# EAGLE design UltiMem_v1.01 (EAGLE 7.6.0)

## Sheet 1 of 5: LOGIC
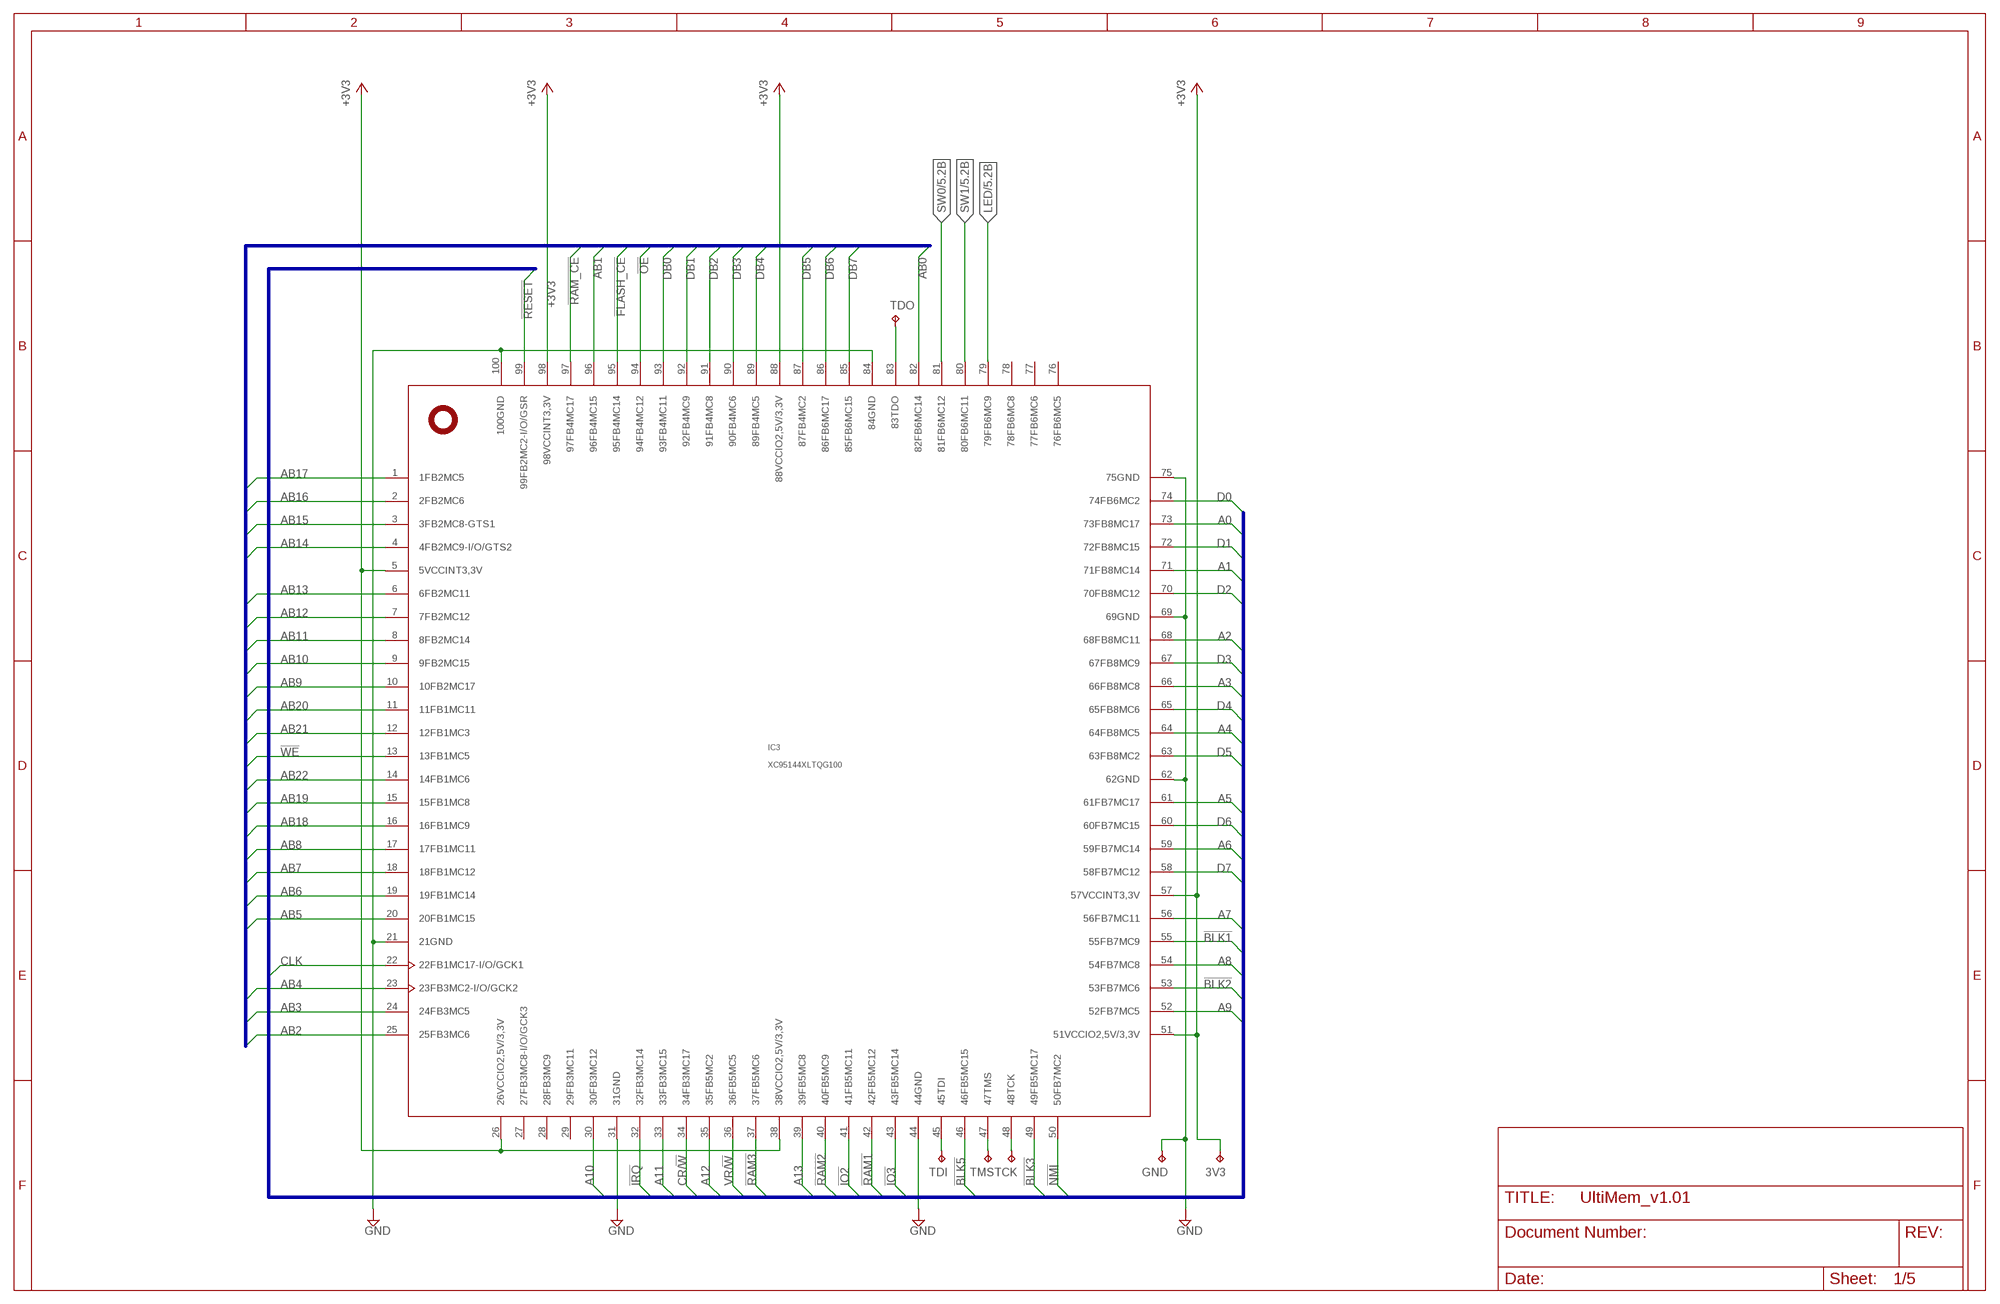
[diagram p0: schematic, sheet 1]

### Parts
3V3  TPTP08R  [TP08R]
GND  TPTP08R  [TP08R]
IC3  XC95144XLTQG100  [TQFP100]
TCK  TPTP08R  [TP08R]
TDI  TPTP08R  [TP08R]
TDO  TPTP08R  [TP08R]
TMS  TPTP08R  [TP08R]

### Nets
!BLK1: IC3.55(55FB7MC9) ; also sheet 3
!BLK2: IC3.53(53FB7MC6) ; also sheet 3
!BLK3: IC3.49(49FB5MC17) ; also sheet 3
!BLK5: IC3.46(46FB5MC15) ; also sheet 3
!FLASH_CE: IC3.95(95FB4MC14) ; also sheet 2
!IO2: IC3.41(41FB5MC11) ; also sheet 3
!IO3: IC3.43(43FB5MC14) ; also sheet 3
!IRQ: IC3.32(32FB3MC14) ; also sheet 3
!NMI: IC3.50(50FB7MC2) ; also sheet 3
!OE: IC3.94(94FB4MC12) ; also sheet 2
!RAM1: IC3.42(42FB5MC12) ; also sheet 3
!RAM2: IC3.40(40FB5MC9) ; also sheet 3
!RAM3: IC3.37(37FB5MC6) ; also sheet 3
!RAM_CE: IC3.97(97FB4MC17) ; also sheet 2
!RESET: IC3.99(99FB2MC2-I/O/GSR) ; also sheet 2,3,5
!WE: IC3.13(13FB1MC5) ; also sheet 2
+3V3: 3V3.TP IC3.5(5VCCINT3,3V) IC3.26(26VCCIO2,5V/3,3V) IC3.38(38VCCIO2,5V/3,3V) IC3.51(51VCCIO2,5V/3,3V) IC3.57(57VCCINT3,3V) IC3.88(88VCCIO2,5V/3,3V) IC3.98(98VCCINT3,3V) ; also sheet 2,4,5
A0: IC3.73(73FB8MC17) ; also sheet 3
A1: IC3.71(71FB8MC14) ; also sheet 3
A2: IC3.68(68FB8MC11) ; also sheet 3
A3: IC3.66(66FB8MC8) ; also sheet 3
A4: IC3.64(64FB8MC5) ; also sheet 3
A5: IC3.61(61FB7MC17) ; also sheet 3
A6: IC3.59(59FB7MC14) ; also sheet 3
A7: IC3.56(56FB7MC11) ; also sheet 3
A8: IC3.54(54FB7MC8) ; also sheet 3
A9: IC3.52(52FB7MC5) ; also sheet 3
A10: IC3.30(30FB3MC12) ; also sheet 3
A11: IC3.33(33FB3MC15) ; also sheet 3
A12: IC3.35(35FB5MC2) ; also sheet 3
A13: IC3.39(39FB5MC8) ; also sheet 3
AB0: IC3.82(82FB6MC14) ; also sheet 2
AB1: IC3.96(96FB4MC15) ; also sheet 2
AB2: IC3.25(25FB3MC6) ; also sheet 2
AB3: IC3.24(24FB3MC5) ; also sheet 2
AB4: IC3.23(23FB3MC2-I/O/GCK2) ; also sheet 2
AB5: IC3.20(20FB1MC15) ; also sheet 2
AB6: IC3.19(19FB1MC14) ; also sheet 2
AB7: IC3.18(18FB1MC12) ; also sheet 2
AB8: IC3.17(17FB1MC11) ; also sheet 2
AB9: IC3.10(10FB2MC17) ; also sheet 2
AB10: IC3.9(9FB2MC15) ; also sheet 2
AB11: IC3.8(8FB2MC14) ; also sheet 2
AB12: IC3.7(7FB2MC12) ; also sheet 2
AB13: IC3.6(6FB2MC11) ; also sheet 2
AB14: IC3.4(4FB2MC9-I/O/GTS2) ; also sheet 2
AB15: IC3.3(3FB2MC8-GTS1) ; also sheet 2
AB16: IC3.2(2FB2MC6) ; also sheet 2
AB17: IC3.1(1FB2MC5) ; also sheet 2
AB18: IC3.16(16FB1MC9) ; also sheet 2
AB19: IC3.15(15FB1MC8) ; also sheet 2
AB20: IC3.11(11FB1MC11) ; also sheet 2
AB21: IC3.12(12FB1MC3) ; also sheet 2
AB22: IC3.14(14FB1MC6) ; also sheet 2
CLK: IC3.22(22FB1MC17-I/O/GCK1) ; also sheet 3
CR/!W: IC3.34(34FB3MC17) ; also sheet 3
D0: IC3.74(74FB6MC2) ; also sheet 3
D1: IC3.72(72FB8MC15) ; also sheet 3
D2: IC3.70(70FB8MC12) ; also sheet 3
D3: IC3.67(67FB8MC9) ; also sheet 3
D4: IC3.65(65FB8MC6) ; also sheet 3
D5: IC3.63(63FB8MC2) ; also sheet 3
D6: IC3.60(60FB7MC15) ; also sheet 3
D7: IC3.58(58FB7MC12) ; also sheet 3
DB0: IC3.93(93FB4MC11) ; also sheet 2
DB1: IC3.92(92FB4MC9) ; also sheet 2
DB2: IC3.91(91FB4MC8) ; also sheet 2
DB3: IC3.90(90FB4MC6) ; also sheet 2
DB4: IC3.89(89FB4MC5) ; also sheet 2
DB5: IC3.87(87FB4MC2) ; also sheet 2
DB6: IC3.86(86FB6MC17) ; also sheet 2
DB7: IC3.85(85FB6MC15) ; also sheet 2
GND: GND.TP IC3.21(21GND) IC3.31(31GND) IC3.44(44GND) IC3.62(62GND) IC3.69(69GND) IC3.75(75GND) IC3.84(84GND) IC3.100(100GND) ; also sheet 2,4,5
LED: IC3.79(79FB6MC9) ; also sheet 5
N$5: IC3.45(45TDI) TDI.TP
N$6: IC3.47(47TMS) TMS.TP
N$7: IC3.48(48TCK) TCK.TP
N$8: IC3.83(83TDO) TDO.TP
SW0: IC3.81(81FB6MC12) ; also sheet 5
SW1: IC3.80(80FB6MC11) ; also sheet 5
VR/!W: IC3.36(36FB5MC5) ; also sheet 3
Unconnected: IC3.27(27FB3MC8-I/O/GCK3) IC3.28(28FB3MC9) IC3.29(29FB3MC11) IC3.76(76FB6MC5) IC3.77(77FB6MC6) IC3.78(78FB6MC8)

### Buses
D[0..7],A[0..13],CLK,CR/!W,VR/!W,!IRQ,!NMI,SND,!RESET,!RAM[1..3],!BLK1,!BLK2,!BLK3,!BLK5,!IO[2..3]
DB[0..7],AB[0..23],!FLASH_CE,!RAM_CE,!OE,!WE,!RB,!BRESET,!BYTE,ACC/!WP

## Sheet 2 of 5: MEMORY
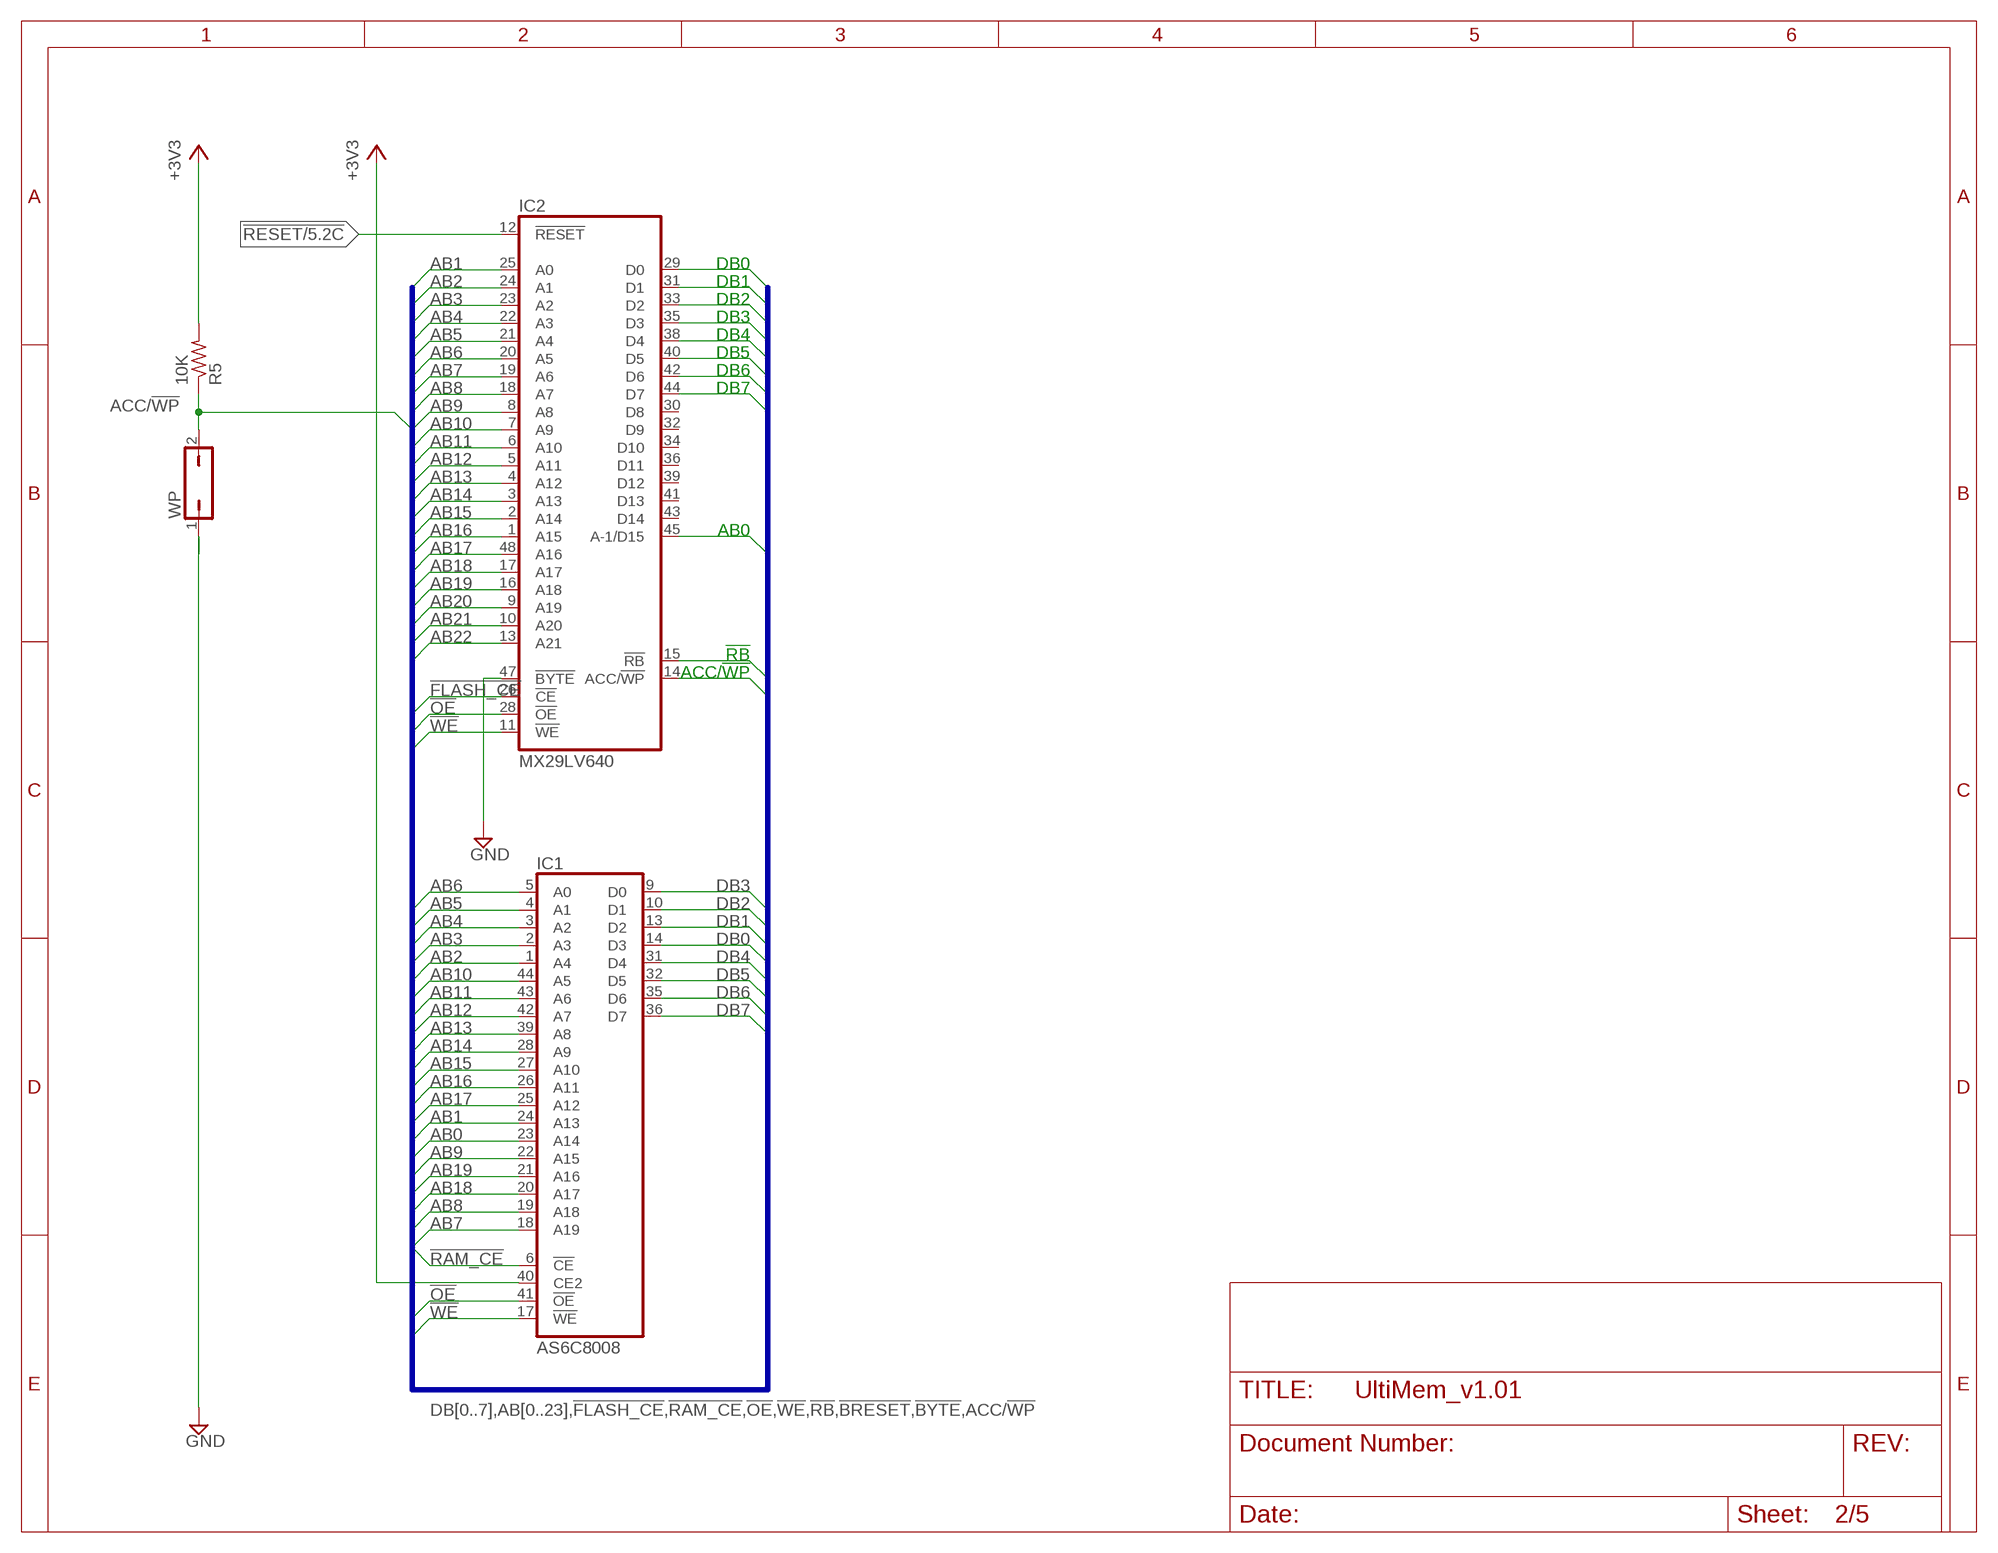
[diagram p1: schematic, sheet 2]

### Parts
IC1  AS6C8008  [TSOP44]
IC2  MX29LV640  [TSOP48]
R5  10K  R-US_R0402  [R0402]
WP  JP1Q  [JP1]

### Nets
!FLASH_CE: IC2.26(!CE) ; also sheet 1
!OE: IC1.41(!OE) IC2.28(!OE) ; also sheet 1
!RAM_CE: IC1.6(!CE) ; also sheet 1
!RB: IC2.15(!RB)
!RESET: IC2.12(!RESET) ; also sheet 1,3,5
!WE: IC1.17(!WE) IC2.11(!WE) ; also sheet 1
+3V3: IC1.40(CE2) R5.2 ; also sheet 1,4,5
AB0: IC1.23(A14) IC2.45(A-1/D15) ; also sheet 1
AB1: IC1.24(A13) IC2.25(A0) ; also sheet 1
AB2: IC1.1(A4) IC2.24(A1) ; also sheet 1
AB3: IC1.2(A3) IC2.23(A2) ; also sheet 1
AB4: IC1.3(A2) IC2.22(A3) ; also sheet 1
AB5: IC1.4(A1) IC2.21(A4) ; also sheet 1
AB6: IC1.5(A0) IC2.20(A5) ; also sheet 1
AB7: IC1.18(A19) IC2.19(A6) ; also sheet 1
AB8: IC1.19(A18) IC2.18(A7) ; also sheet 1
AB9: IC1.22(A15) IC2.8(A8) ; also sheet 1
AB10: IC1.44(A5) IC2.7(A9) ; also sheet 1
AB11: IC1.43(A6) IC2.6(A10) ; also sheet 1
AB12: IC1.42(A7) IC2.5(A11) ; also sheet 1
AB13: IC1.39(A8) IC2.4(A12) ; also sheet 1
AB14: IC1.28(A9) IC2.3(A13) ; also sheet 1
AB15: IC1.27(A10) IC2.2(A14) ; also sheet 1
AB16: IC1.26(A11) IC2.1(A15) ; also sheet 1
AB17: IC1.25(A12) IC2.48(A16) ; also sheet 1
AB18: IC1.20(A17) IC2.17(A17) ; also sheet 1
AB19: IC1.21(A16) IC2.16(A18) ; also sheet 1
AB20: IC2.9(A19) ; also sheet 1
AB21: IC2.10(A20) ; also sheet 1
AB22: IC2.13(A21) ; also sheet 1
ACC/!WP: IC2.14(ACC/!WP) R5.1 WP.2
DB0: IC1.14(D3) IC2.29(D0) ; also sheet 1
DB1: IC1.13(D2) IC2.31(D1) ; also sheet 1
DB2: IC1.10(D1) IC2.33(D2) ; also sheet 1
DB3: IC1.9(D0) IC2.35(D3) ; also sheet 1
DB4: IC1.31(D4) IC2.38(D4) ; also sheet 1
DB5: IC1.32(D5) IC2.40(D5) ; also sheet 1
DB6: IC1.35(D6) IC2.42(D6) ; also sheet 1
DB7: IC1.36(D7) IC2.44(D7) ; also sheet 1
GND: IC2.47(!BYTE) WP.1 ; also sheet 1,4,5
Unconnected: IC2.30(D8) IC2.32(D9) IC2.34(D10) IC2.36(D11) IC2.39(D12) IC2.41(D13) IC2.43(D14)

### Buses
DB[0..7],AB[0..23],!FLASH_CE,!RAM_CE,!OE,!WE,!RB,!BRESET,!BYTE,ACC/!WP

## Sheet 3 of 5: INTERFACE
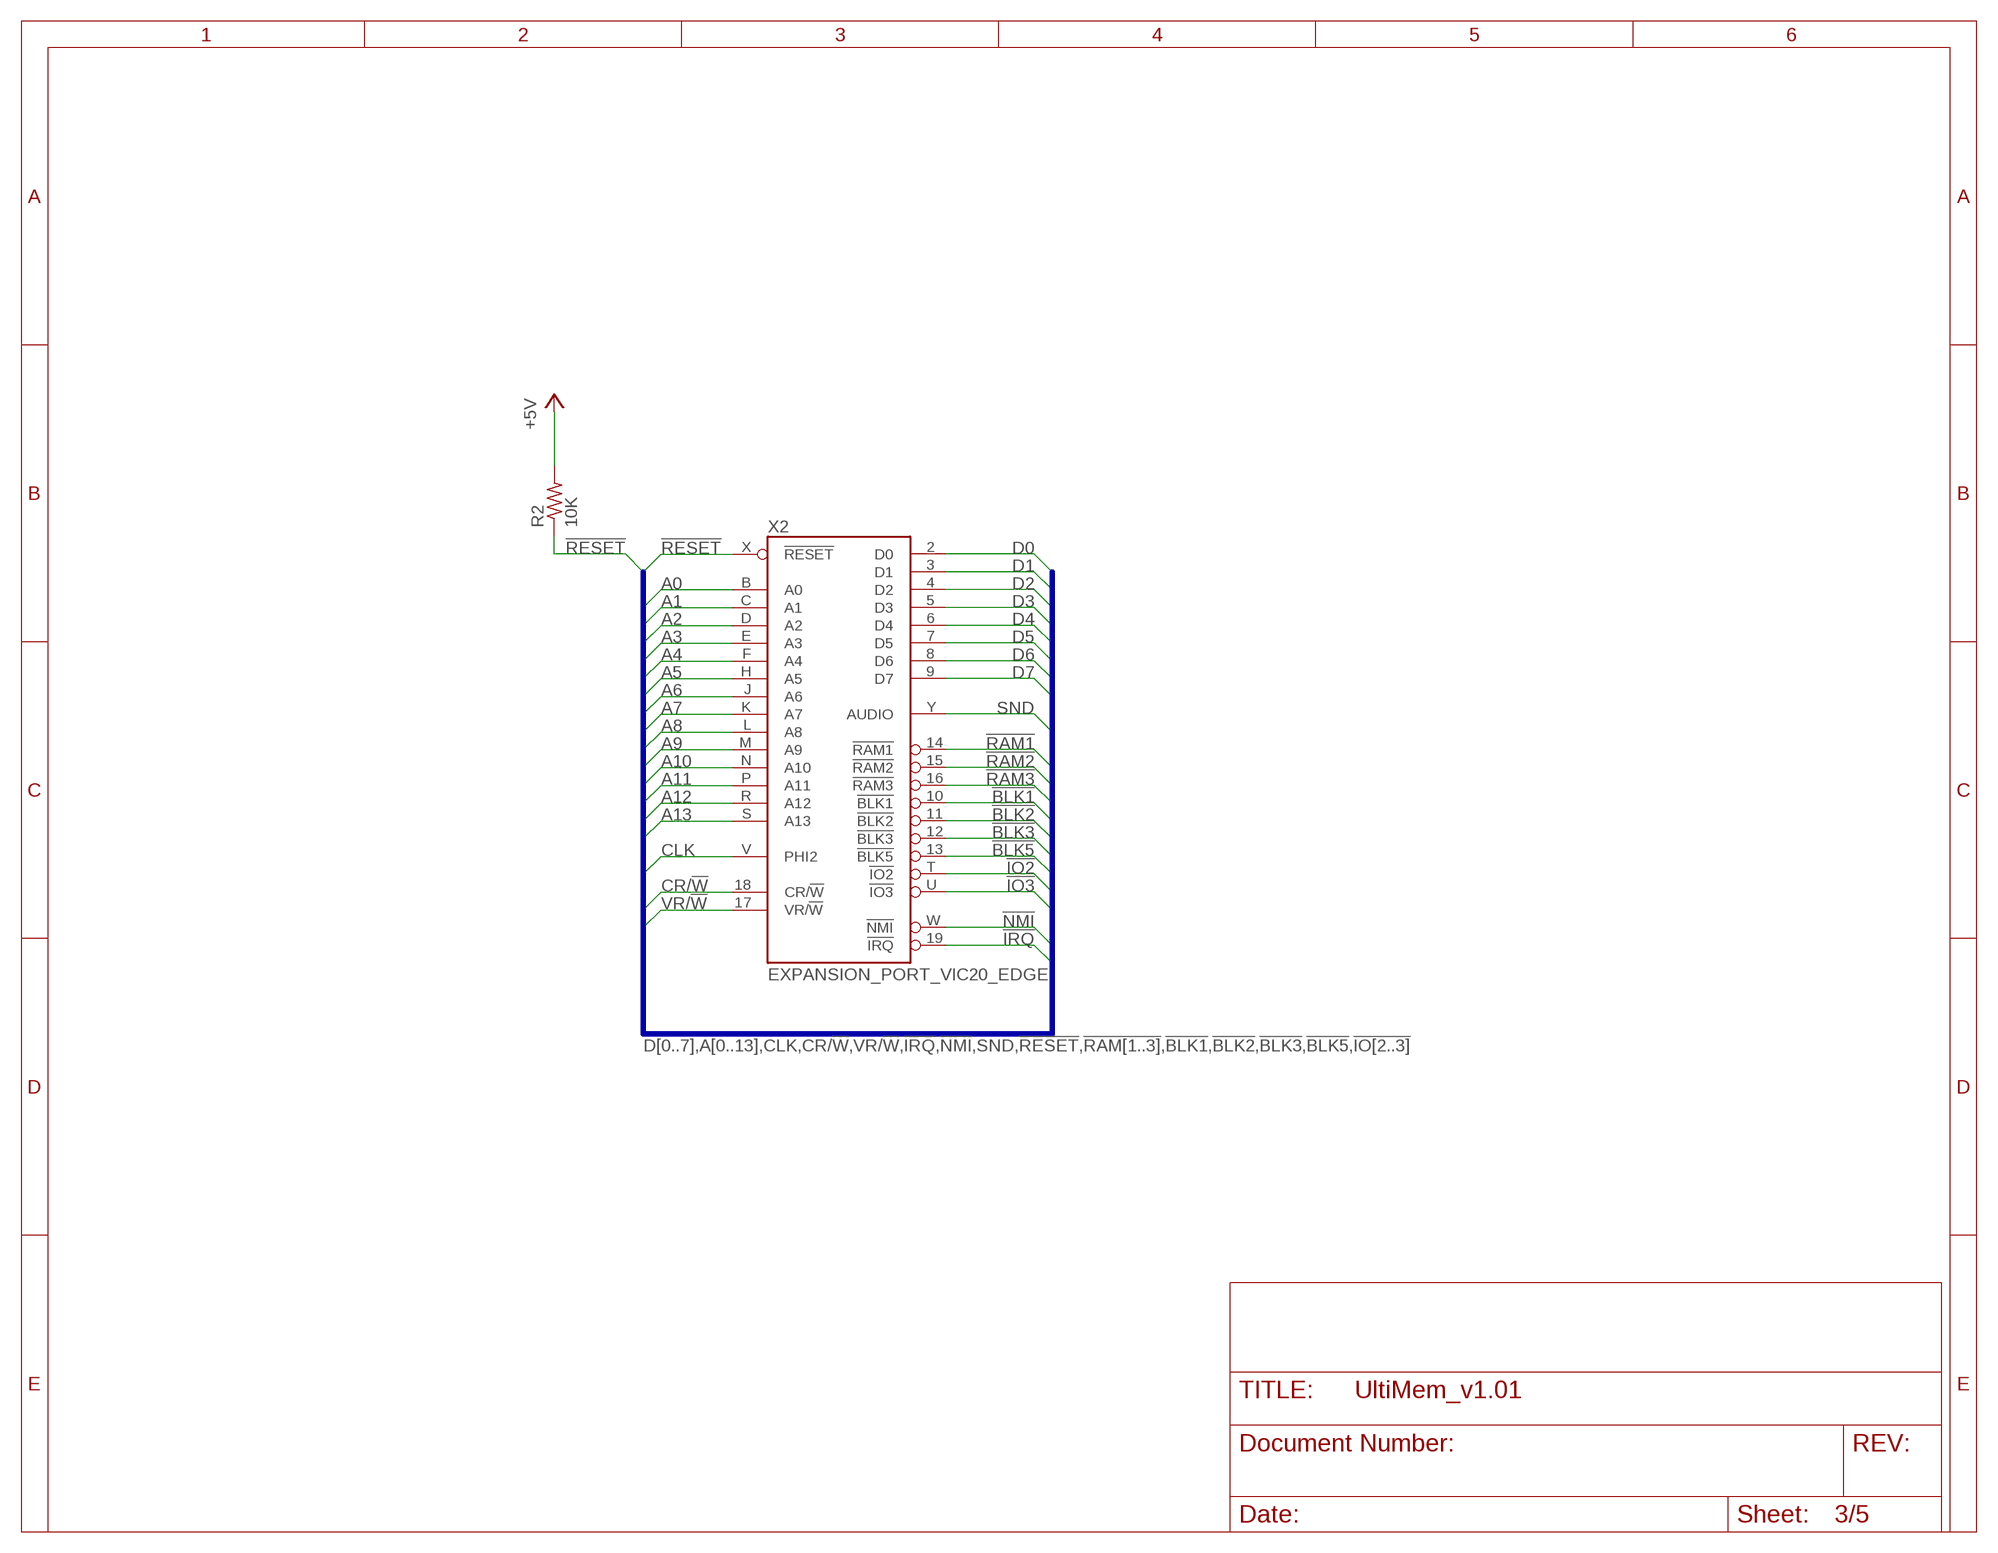
[diagram p2: schematic, sheet 3]

### Parts
R2  10K  R-US_R0402  [R0402]
X2  EXPANSION_PORT_VIC20_EDGE  [MA156-22-2]

### Nets
!BLK1: X2.10(!BLK1) ; also sheet 1
!BLK2: X2.11(!BLK2) ; also sheet 1
!BLK3: X2.12(!BLK3) ; also sheet 1
!BLK5: X2.13(!BLK5) ; also sheet 1
!IO2: X2.T(!IO2) ; also sheet 1
!IO3: X2.U(!IO3) ; also sheet 1
!IRQ: X2.19(!IRQ) ; also sheet 1
!NMI: X2.W(!NMI) ; also sheet 1
!RAM1: X2.14(!RAM1) ; also sheet 1
!RAM2: X2.15(!RAM2) ; also sheet 1
!RAM3: X2.16(!RAM3) ; also sheet 1
!RESET: R2.1 X2.X(!RESET) ; also sheet 1,2,5
+5V: R2.2 ; also sheet 4
A0: X2.B(A0) ; also sheet 1
A1: X2.C(A1) ; also sheet 1
A2: X2.D(A2) ; also sheet 1
A3: X2.E(A3) ; also sheet 1
A4: X2.F(A4) ; also sheet 1
A5: X2.H(A5) ; also sheet 1
A6: X2.J(A6) ; also sheet 1
A7: X2.K(A7) ; also sheet 1
A8: X2.L(A8) ; also sheet 1
A9: X2.M(A9) ; also sheet 1
A10: X2.N(A10) ; also sheet 1
A11: X2.P(A11) ; also sheet 1
A12: X2.R(A12) ; also sheet 1
A13: X2.S(A13) ; also sheet 1
CLK: X2.V(PHI2) ; also sheet 1
CR/!W: X2.18(CR/!W) ; also sheet 1
D0: X2.2(D0) ; also sheet 1
D1: X2.3(D1) ; also sheet 1
D2: X2.4(D2) ; also sheet 1
D3: X2.5(D3) ; also sheet 1
D4: X2.6(D4) ; also sheet 1
D5: X2.7(D5) ; also sheet 1
D6: X2.8(D6) ; also sheet 1
D7: X2.9(D7) ; also sheet 1
SND: X2.Y(AUDIO)
VR/!W: X2.17(VR/!W) ; also sheet 1

### Buses
D[0..7],A[0..13],CLK,CR/!W,VR/!W,!IRQ,!NMI,SND,!RESET,!RAM[1..3],!BLK1,!BLK2,!BLK3,!BLK5,!IO[2..3]

## Sheet 4 of 5: POWER
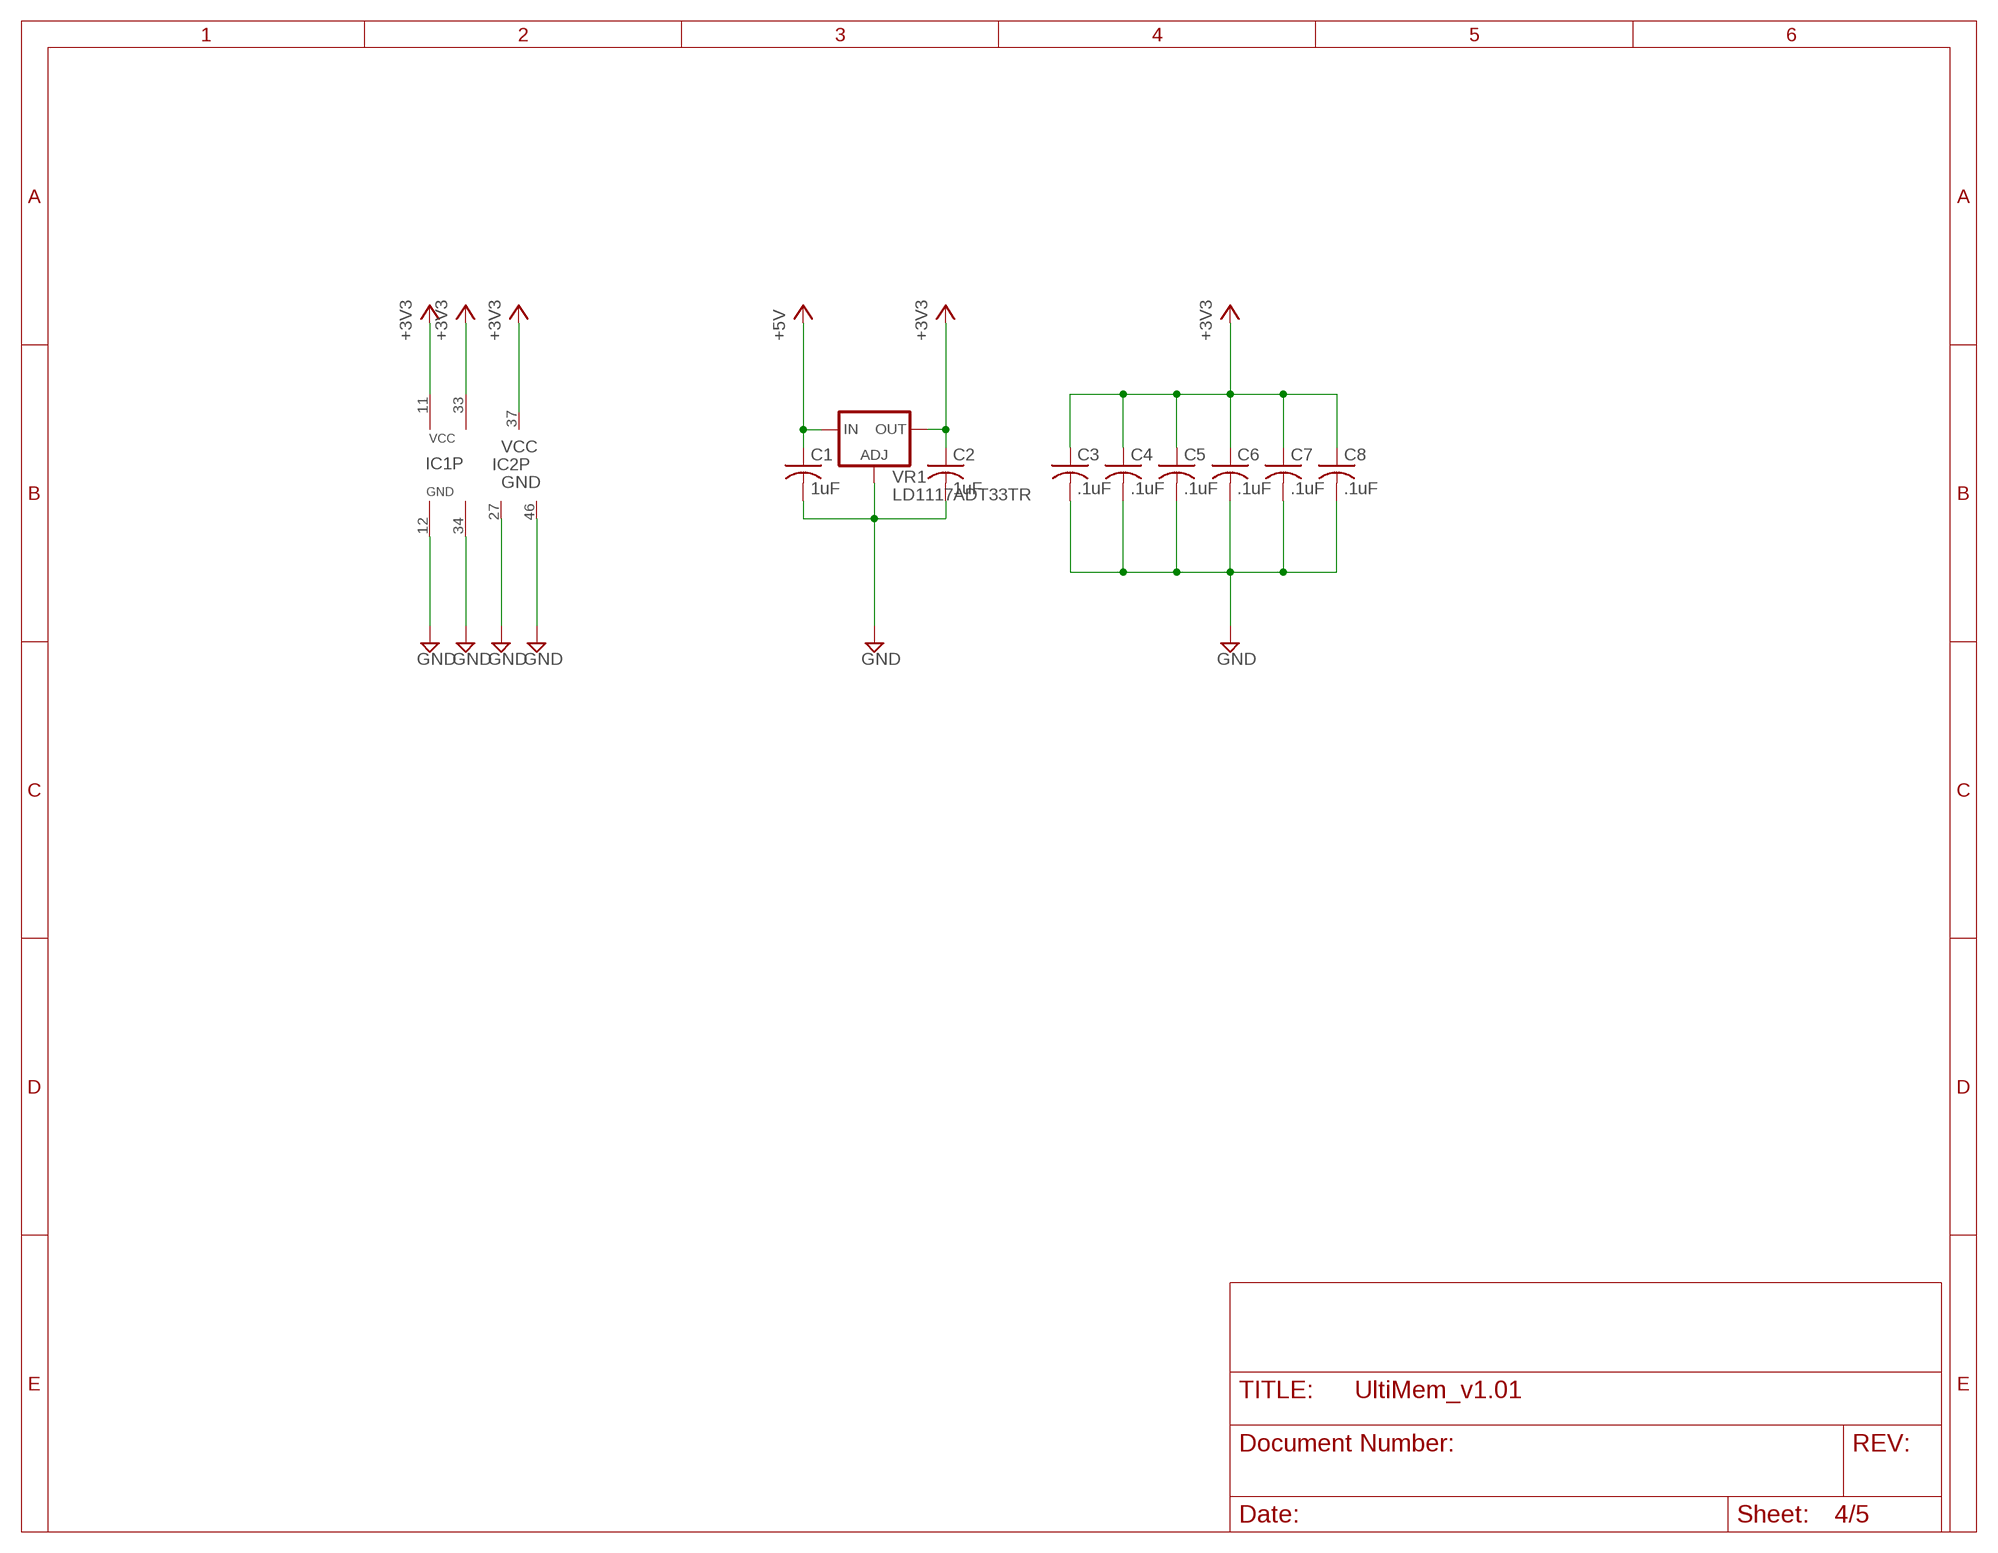
[diagram p3: schematic, sheet 4]

### Parts
C1  1uF  C-USC0402  [C0402]
C2  1uF  C-USC0402  [C0402]
C3  .1uF  C-USC0402  [C0402]
C4  .1uF  C-USC0402  [C0402]
C5  .1uF  C-USC0402  [C0402]
C6  .1uF  C-USC0402  [C0402]
C7  .1uF  C-USC0402  [C0402]
C8  .1uF  C-USC0402  [C0402]
VR1  LD1117ADT33TR  LD117ADT33TR  [DPACK]

### Nets
+3V3: C2.1 C3.1 C4.1 C5.1 C6.1 C7.1 C8.1 IC1.11(VCC) IC1.33(VCC) IC2.37(VCC) VR1.4(OUT) ; also sheet 1,2,5
+5V: C1.1 VR1.3(IN) ; also sheet 3
GND: C1.2 C2.2 C3.2 C4.2 C5.2 C6.2 C7.2 C8.2 IC1.12(GND) IC1.34(GND) IC2.27(GND) IC2.46(GND) VR1.1(ADJ) ; also sheet 1,2,5

## Sheet 5 of 5: IO
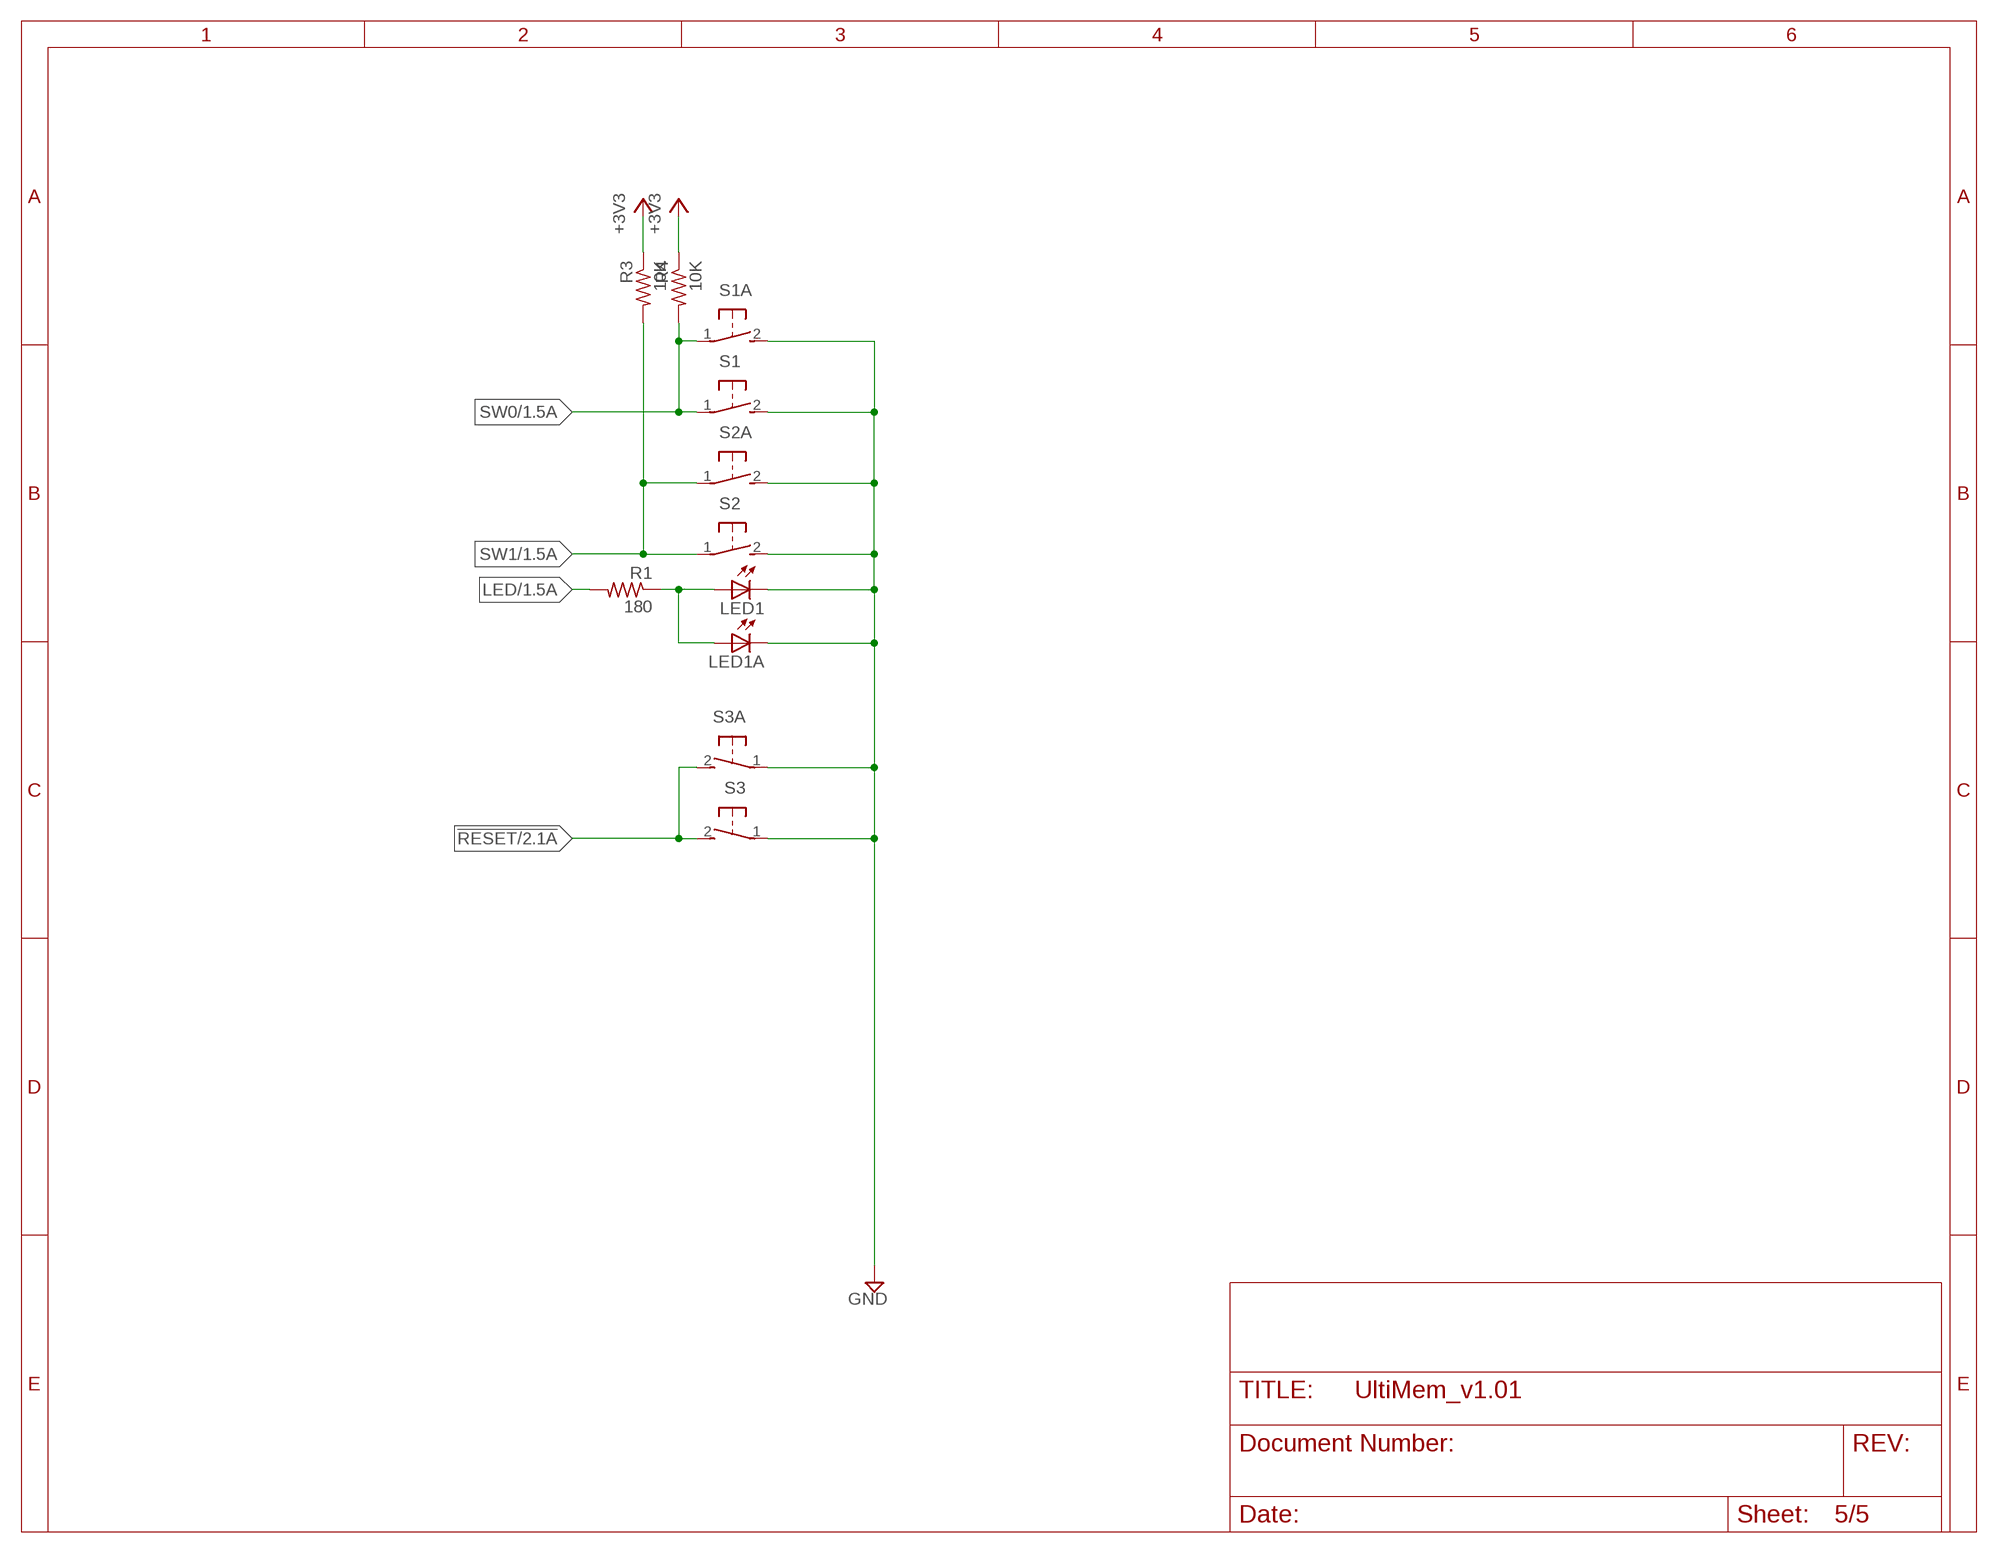
[diagram p4: schematic, sheet 5]

### Parts
LED1  LED3MM  [LED3MM]
LED1A  LED3MM  [LED3MM]
R1  180  R-US_R0402  [R0402]
R3  10K  R-US_R0402  [R0402]
R4  10K  R-US_R0402  [R0402]
S1  31-XX  [B3F-31XX]
S1A  31-XX  [B3F-31XX]
S2  31-XX  [B3F-31XX]
S2A  31-XX  [B3F-31XX]
S3  31-XX  [B3F-31XX]
S3A  31-XX  [B3F-31XX]

### Nets
!RESET: S3.2(S) S3A.2(S) ; also sheet 1,2,3
+3V3: R3.1 R4.1 ; also sheet 1,2,4
GND: LED1.K(C) LED1A.K(C) S1.2(S) S1A.2(S) S2.2(S) S2A.2(S) S3.1(P) S3A.1(P) ; also sheet 1,2,4
LED: R1.2 ; also sheet 1
N$3: LED1.A LED1A.A R1.1
SW0: R4.2 S1.1(P) S1A.1(P) ; also sheet 1
SW1: R3.2 S2.1(P) S2A.1(P) ; also sheet 1

## Power pins joined to a net without a drawn wire
GND: X2.1(GND) X2.22(GND) X2.A(GND) X2.Z(GND)
VCC: X2.21(VCC)

## Library data of the parts
3V3 GND TCK TDI TDO TMS = testpad:TP: Test pad
C1-C8 = rcl:C-US: CAPACITOR, American symbol
IC1 = memory--alliance:AS6C8008
IC2 = memory-macronix:MX29LV640
IC3 = xilinx_xc95XXXxl:XC95144XLTQG100
LED1 LED1A = led:LED: LED OSRAM: - CHIPLED LG R971, LG N971, LY N971, LG Q971, LY Q971, LO R971, LY R971 LH N974, LH R974 LS Q976, LO Q976, LY Q976 LO Q996 - Hyper CHIPLED LW Q18S LB Q993, LB Q99A, LB R99A - SideLED LS A670, LO A670, LY A670, LG A670, LP A670 LB A673, LV A673, LT A673, LW A673 LH A674 LY A675 LS A676, LA A676, LO A676, LY A676, LW A676 LS A679, LY A679, LG A679 - Hyper Micro SIDELED® LS Y876, LA Y876, LO Y876, LY Y876 LT Y87S - SmartLED LW L88C, LW L88S LB L89C, LB L89S, LG L890 LS L89K, LO L89K, LY L89K LS L896, LA L896, LO L896, LY L896 - TOPLED LS T670, LO T670, LY T670, LG T670, LP T670 LSG T670, LSP T670, LSY T670, LOP T670, LYG T670 LG T671, LOG T671, LSG T671 LB T673, LV T673, LT T673, LW T673 LH T674 LS T676, LA T676, LO T676, LY T676, LB T676, LH T676, LSB T676, LW T676 LB T67C, LV T67C, LT T67C, LS T67K, LO T67K, LY T67K, LW E67C LS E67B, LA E67B, LO E67B, LY E67B, LB E67C, LV E67C, LT E67C LW T67C LS T679, LY T679, LG T679 LS T770, LO T770, LY T770, LG T770, LP T770 LB T773, LV T773, LT T773, LW T773 LH T774 LS E675, LA E675, LY E675, LS T675 LS T776, LA T776, LO T776, LY T776, LB T776 LHGB T686 LT T68C, LB T68C - Hyper Mini TOPLED® LB M676 - Mini TOPLED Santana® LG M470 LS M47K, LO M47K, LY M47K Source: http://www.osram.convergy.de LUXEON: - LUMILED® LXK2-PW12-R00, LXK2-PW12-S00, LXK2-PW14-U00, LXK2-PW14-V00 LXK2-PM12-R00, LXK2-PM12-S00, LXK2-PM14-U00 LXK2-PE12-Q00, LXK2-PE12-R00, LXK2-PE12-S00, LXK2-PE14-T00, LXK2-PE14-U00 LXK2-PB12-K00, LXK2-PB12-L00, LXK2-PB12-M00, LXK2-PB14-N00, LXK2-PB14-P00, LXK2-PB14-Q00 LXK2-PR12-L00, LXK2-PR12-M00, LXK2-PR14-Q00, LXK2-PR14-R00 LXK2-PD12-Q00, LXK2-PD12-R00, LXK2-PD12-S00 LXK2-PH12-R00, LXK2-PH12-S00 LXK2-PL12-P00, LXK2-PL12-Q00, LXK2-PL12-R00 Source: www.luxeon.com KINGBRIGHT: KA-3528ASYC Source: www.kingbright.com
R1 R3-R5 = rcl:R-US_: RESISTOR, American symbol
R2 = resistor:R-US_: RESISTOR, American symbol
S1 S1A S2 S2A S3 S3A = switch-omron:31-XX: OMRON SWITCH; MPN: B3F-3100; OC_FARNELL: 959704; OC_NEWARK: 36M3582
VR1 = v-reg:LD117A?*: Low drop fixed and adjustable positive voltage regulators 1 A Source: http://www.st.com/stonline/products/literature/ds/7194/ld1117axx.pdf
WP = jumper:JP1Q: JUMPER
X2 = commodore:EXPANSION_PORT_VIC20_EDGE: Expansionport of the Commodore VIC-20

## Board
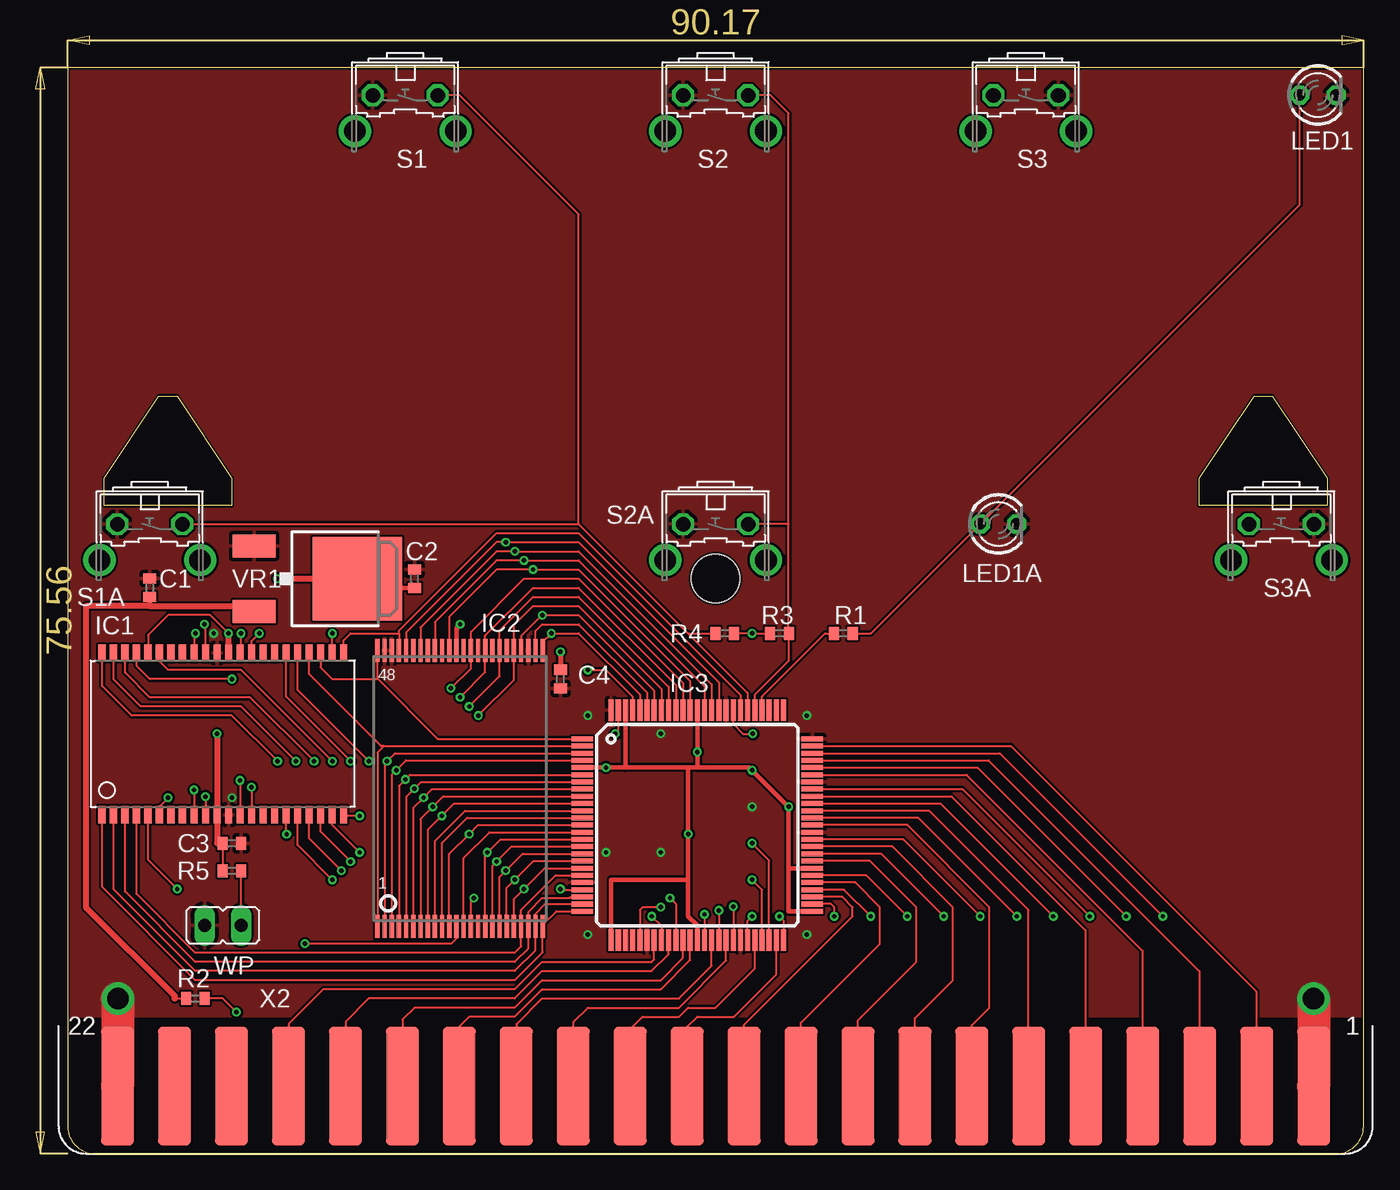
[diagram p5: board, top side]
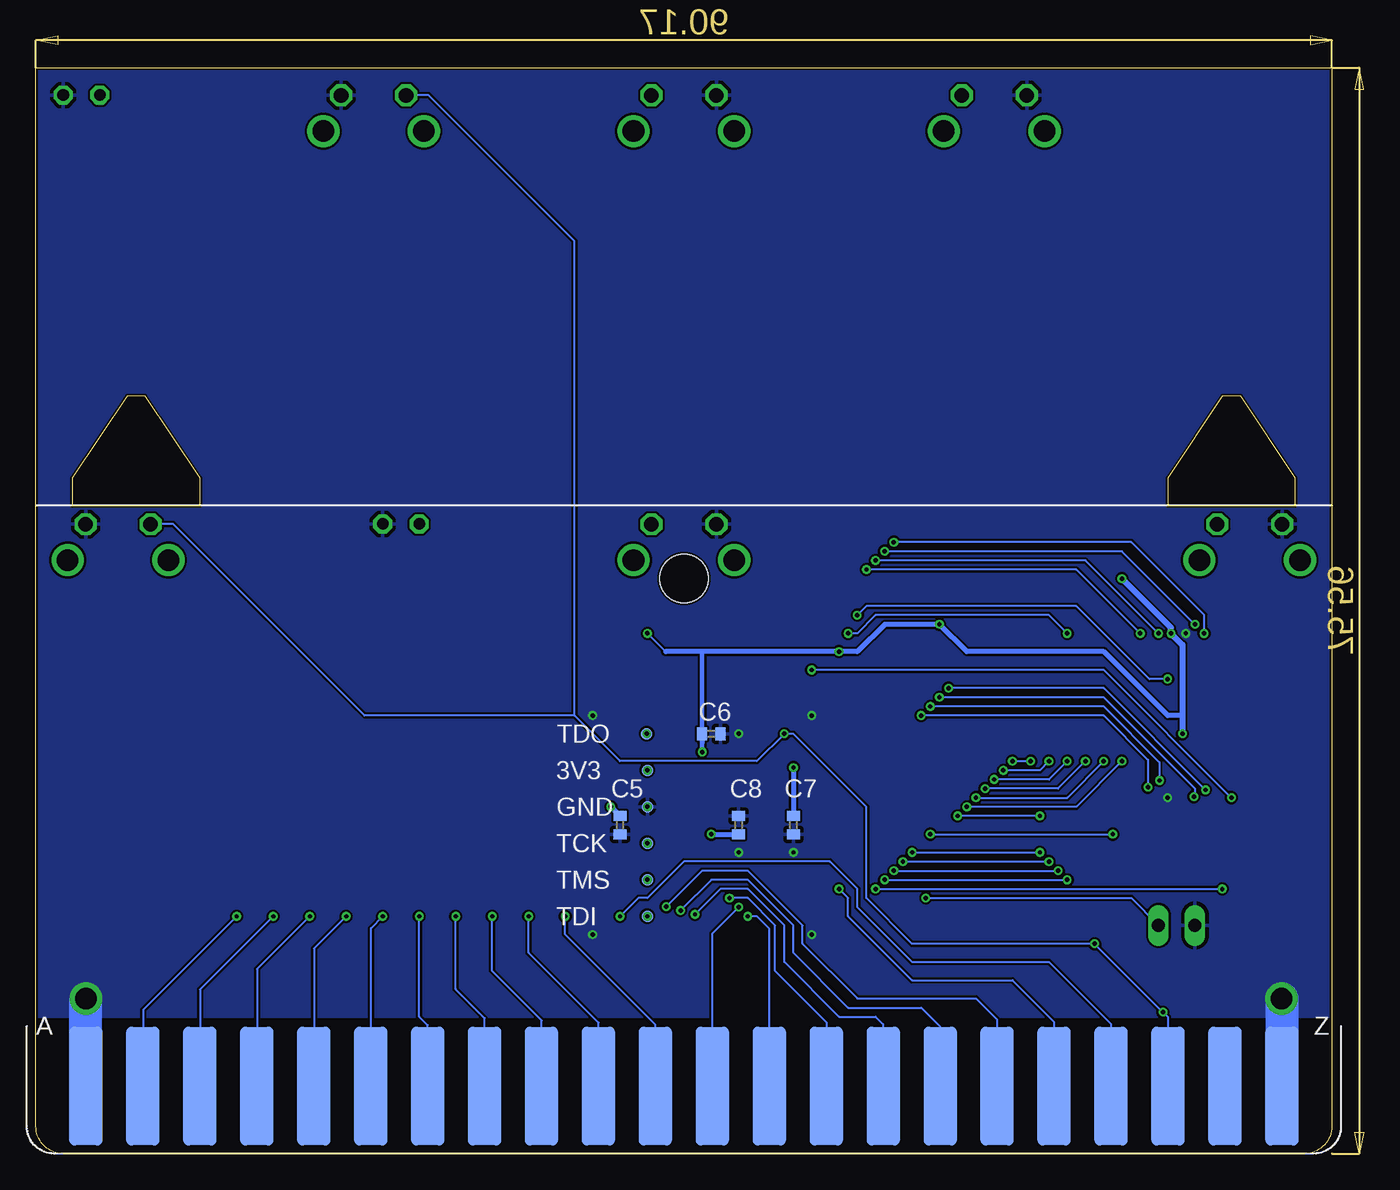
[diagram p6: board, bottom side, seen from below]

Size 90.17 x 75.56 mm. Coordinates in mm from the lower left corner, seen from the top.
Outline: 90.17,75.56 0,75.56 0,1.91 arc90 1.91,0 88.27,0 arc90 90.17,1.91 90.17,75.56
Outline: 2.54,45.09 2.54,46.99 6.35,52.7 7.62,52.7 11.43,46.99 11.43,45.09 2.54,45.09
Outline: 78.74,45.09 78.74,46.99 82.55,52.7 83.82,52.7 87.63,46.99 87.63,45.09 78.74,45.09
Copper layers (1*16): Top 0.035mm / dielectric 1.5mm / Bottom 0.035mm
Design rules "hackvana *": minimum track width 6mil, minimum drill 0.3mm, track to track 0.1501mm, track to pad 0.1501mm, pad to pad 0.1501mm, via to via 0.1501mm, smd to smd 0mil, copper to edge 6mil, drill to drill 6mil, minimum pad ring 10mil, minimum via ring 6mil, stop-mask expansion 2mil, vias tented up to drill 100mil, thermal gap 10mil
Holes 3.38 mm at 45.09,40.01

### Footprints (pad centres in the part's own frame; a part is rotated, then mirrored left to right if it is on the bottom)
TP08R = smd 0.8 x 0.8: TP 0,0
C0402 = smd 0.7 x 0.9: 1 -0.65,0; 2 0.65,0
TSOP44 = smd 0.5 x 1.2: 1 -8.4,-5.627; 2 -7.6,-5.627; 3 -6.8,-5.627; 4 -6,-5.627; 5 -5.2,-5.627; 6 -4.4,-5.627; 7 -3.6,-5.627; 8 -2.8,-5.627; 9 -2,-5.627; 10 -1.2,-5.627; 11 -0.4,-5.627; 12 0.4,-5.627; 13 1.2,-5.627; 14 2,-5.627; 15 2.8,-5.627; 16 3.6,-5.627; 17 4.4,-5.627; 18 5.2,-5.627; 19 6,-5.627; 20 6.8,-5.627; 21 7.6,-5.627; 22 8.4,-5.627; 23 8.4,5.627; 24 7.6,5.627; 25 6.8,5.627; 26 6,5.627; 27 5.2,5.627; 28 4.4,5.627; 29 3.6,5.627; 30 2.8,5.627; 31 2,5.627; 32 1.2,5.627; 33 0.4,5.627; 34 -0.4,5.627; 35 -1.2,5.627; 36 -2,5.627; 37 -2.8,5.627; 38 -3.6,5.627; 39 -4.4,5.627; 40 -5.2,5.627; 41 -6,5.627; 42 -6.8,5.627; 43 -7.6,5.627; 44 -8.4,5.627
TSOP48 = smd 1.6 x 0.3: 1 -9.6,5.75; 2 -9.6,5.25; 3 -9.6,4.75; 4 -9.6,4.25; 5 -9.6,3.75; 6 -9.6,3.25; 7 -9.6,2.75; 8 -9.6,2.25; 9 -9.6,1.75; 10 -9.6,1.25; 11 -9.6,0.75; 12 -9.6,0.25; 13 -9.6,-0.25; 14 -9.6,-0.75; 15 -9.6,-1.25; 16 -9.6,-1.75; 17 -9.6,-2.25; 18 -9.6,-2.75; 19 -9.6,-3.25; 20 -9.6,-3.75; 21 -9.6,-4.25; 22 -9.6,-4.75; 23 -9.6,-5.25; 24 -9.6,-5.75; 25 9.6,-5.75; 26 9.6,-5.25; 27 9.6,-4.75; 28 9.6,-4.25; 29 9.6,-3.75; 30 9.6,-3.25; 31 9.6,-2.75; 32 9.6,-2.25; 33 9.6,-1.75; 34 9.6,-1.25; 35 9.6,-0.75; 36 9.6,-0.25; 37 9.6,0.25; 38 9.6,0.75; 39 9.6,1.25; 40 9.6,1.75; 41 9.6,2.25; 42 9.6,2.75; 43 9.6,3.25; 44 9.6,3.75; 45 9.6,4.25; 46 9.6,4.75; 47 9.6,5.25; 48 9.6,5.75
TQFP100 = smd 1.5 x 0.35: 1 -8,6; 2 -8,5.5; 3 -8,5; 4 -8,4.5; 5 -8,4; 6 -8,3.5; 7 -8,3; 8 -8,2.5; 9 -8,2; 10 -8,1.5; 11 -8,1; 12 -8,0.5; 13 -8,0; 14 -8,-0.5; 15 -8,-1; 16 -8,-1.5; 17 -8,-2; 18 -8,-2.5; 19 -8,-3; 20 -8,-3.5; 21 -8,-4; 22 -8,-4.5; 23 -8,-5; 24 -8,-5.5; 25 -8,-6; 51 8,-6; 52 8,-5.5; 53 8,-5; 54 8,-4.5; 55 8,-4; 56 8,-3.5; 57 8,-3; 58 8,-2.5; 59 8,-2; 60 8,-1.5; 61 8,-1; 62 8,-0.5; 63 8,0; 64 8,0.5; 65 8,1; 66 8,1.5; 67 8,2; 68 8,2.5; 69 8,3; 70 8,3.5; 71 8,4; 72 8,4.5; 73 8,5; 74 8,5.5; 75 8,6 | smd 0.35 x 1.5: 26 -6,-8; 27 -5.5,-8; 28 -5,-8; 29 -4.5,-8; 30 -4,-8; 31 -3.5,-8; 32 -3,-8; 33 -2.5,-8; 34 -2,-8; 35 -1.5,-8; 36 -1,-8; 37 -0.5,-8; 38 0,-8; 39 0.5,-8; 40 1,-8; 41 1.5,-8; 42 2,-8; 43 2.5,-8; 44 3,-8; 45 3.5,-8; 46 4,-8; 47 4.5,-8; 48 5,-8; 49 5.5,-8; 50 6,-8; 76 6,8; 77 5.5,8; 78 5,8; 79 4.5,8; 80 4,8; 81 3.5,8; 82 3,8; 83 2.5,8; 84 2,8; 85 1.5,8; 86 1,8; 87 0.5,8; 88 0,8; 89 -0.5,8; 90 -1,8; 91 -1.5,8; 92 -2,8; 93 -2.5,8; 94 -3,8; 95 -3.5,8; 96 -4,8; 97 -4.5,8; 98 -5,8; 99 -5.5,8; 100 -6,8
LED3MM = drill 0.813 octagon: A -1.27,0; K 1.27,0
R0402 = smd 0.7 x 0.9: 1 -0.65,0; 2 0.65,0
B3F-31XX = drill 1.016 octagon: 1 -2.261,-1.245; 2 2.261,-1.245 | drill 1.499 pad 2.159: 3 -3.505,1.245; 4 3.505,1.245
DPACK = smd 1.6 x 3: 1 -2.28,-4.8; 3 2.28,-4.8 | smd 5.8 x 6.2: 4 0,2.38
JP1 = drill 0.914 long: 1 0,-1.27; 2 0,1.27
MA156-22-2 = smd 2.286 x 8.255: 1 41.605,-0.381; 2 37.643,-0.381; 3 33.68,-0.381; 4 29.718,-0.381; 5 25.756,-0.381; 6 21.793,-0.381; 7 17.831,-0.381; 8 13.868,-0.381; 9 9.906,-0.381; 10 5.944,-0.381; 11 1.981,-0.381; 12 -1.981,-0.381; 13 -5.944,-0.381; 14 -9.906,-0.381; 15 -13.868,-0.381; 16 -17.831,-0.381; 17 -21.793,-0.381; 18 -25.756,-0.381; 19 -29.718,-0.381; 20 -33.68,-0.381; 21 -37.643,-0.381; 22 -41.605,-0.381 | smd 2.286 x 8.255 bottom: A 41.605,-0.381; B 37.643,-0.381; C 33.68,-0.381; D 29.718,-0.381; E 25.756,-0.381; F 21.793,-0.381; H 17.831,-0.381; J 13.868,-0.381; K 9.906,-0.381; L 5.944,-0.381; M 1.981,-0.381; N -1.981,-0.381; P -5.944,-0.381; R -9.906,-0.381; S -13.868,-0.381; T -17.831,-0.381; U -21.793,-0.381; V -25.756,-0.381; W -29.718,-0.381; X -33.68,-0.381; Y -37.643,-0.381; Z -41.605,-0.381

### Placement (x,y rotation side)
3V3  47.62,26.67 90 bottom
C1  5.72,39.37 90 top
C2  24.13,40.01 90 top
C3  11.43,21.59 0 top
C4  34.29,33.02 270 top
C5  49.53,22.86 270 bottom
C6  43.18,29.21 0 bottom
C7  37.47,22.86 270 bottom
C8  41.27,22.86 90 bottom
GND  47.62,24.13 90 bottom
IC1  10.8,29.21 0 top
IC2  27.3,25.4 90 top
IC3  43.81,22.86 0 top
LED1  87,73.66 0 top
LED1A  64.77,43.81 0 top
R1  53.98,36.2 180 top
R2  8.89,10.79 180 top
R3  49.53,36.2 0 top
R4  45.72,36.2 180 top
R5  11.43,19.68 180 top
S1  23.5,72.39 180 top
S1A  5.72,42.55 180 top
S2  45.09,72.39 180 top
S2A  45.09,42.55 180 top
S3  66.67,72.39 180 top
S3A  84.45,42.55 180 top
TCK  47.62,21.59 90 bottom
TDI  47.62,16.51 90 bottom
TDO  47.68,29.21 90 bottom
TMS  47.62,19.05 90 bottom
VR1  17.78,40.01 270 top
WP  10.8,15.88 270 top
X2  45.09,5.08 0 top

### Tracks (layer width: path | path; a pad name or v marks a point on that pad's centre or on a via)
!BLK1
  Top 0.152: IC3.55 54.8,18.86 56.52,17.14 56.52,14.61 51.02,9.11 X2.10
!BLK2
  Top 0.152: IC3.53 53.9,17.86 54.61,17.14 54.61,16.51 47.06,8.96 X2.11
!BLK3
  Top 0.152: X2.12 43.1,8.81 43.81,9.53 46.36,9.53 49.31,12.48 IC3.49
!BLK5
  Top 0.152: IC3.46 47.81,12.89 45.09,10.16 43.18,10.16 42.55,9.53 40.01,9.53 39.14,8.66 X2.13
!FLASH_CE
  Top 0.152: IC2.26 32.55,36.37 33.02,36.83 35.56,36.83 40.31,32.08 IC3.95
!IO2  (via drill 0.3)
  Top 0.152: v45.31,16.91 IC3.41
  Bottom 0.152: v45.31,16.91 43.18,19.05 40.64,19.05 37.47,15.88 37.47,13.97 33.66,10.16 28.57,10.16 27.26,8.85 X2.T
!IO3  (via drill 0.3)
  Top 0.152: v46.31,17.18 IC3.43
  Bottom 0.152: v46.31,17.18 43.81,19.68 40.64,19.68 36.83,15.88 36.83,14.61 33.02,10.79 24.77,10.79 23.3,9.33 23.3,4.71 X2.U
!IRQ
  Top 0.152: IC3.32 40.81,13.51 40.64,13.34 33.02,13.34 31.12,11.43 17.78,11.43 15.38,9.03 15.38,4.72 X2.19
!NMI  (via drill 0.3)
  Top 0.152: v49.53,16.51 49.81,16.23 IC3.50
  Bottom 0.152: v49.53,16.51 48.26,17.78 47.62,17.78 45.09,20.32 34.92,20.32 33.02,18.41 33.02,17.14 29.21,13.34 19.69,13.34 15.38,9.03 15.38,4.72 X2.W
!OE  (via drill 0.3)
  Top 0.152: IC2.28 31.55,36 v33.02,37.47 35.56,37.47 40.81,32.21 IC3.94 | IC1.41 4.8,33.94 5.72,33.02 v11.43,33.02
  Bottom 0.152: v11.43,33.02 12.7,33.02 17.78,38.1 32.39,38.1 v33.02,37.47
!RAM1
  Top 0.152: IC3.42 45.81,13.43 42.55,10.16 36.2,10.16 35.18,9.15 X2.14
!RAM2
  Top 0.152: IC3.40 44.81,13.06 42.55,10.79 33.02,10.79 31.22,9 X2.15
!RAM3
  Top 0.152: IC3.37 43.31,13.47 41.27,11.43 33.02,11.43 31.12,9.53 27.94,9.53 27.26,8.85 X2.16
!RAM_CE  (via drill 0.3)
  Top 0.152: IC1.6 6.4,24.18 v6.98,24.77 | IC3.97 39.31,31.8 37.47,33.66 v36.2,33.66
  Bottom 0.152: v6.98,24.77 15.88,33.66 v36.2,33.66
!RESET  (via drill 0.3)
  Top 0.152: v38.1,29.21 38.31,29.43 IC3.99 | R2.1 10.8,10.79 v11.75,9.84 | IC2.12 27.05,14.99 26.67,14.61 v16.51,14.61
  Bottom 0.152: X2.X 11.42,4.72 11.42,9.52 v11.75,9.84 v16.51,14.61 29.21,14.61 32.39,17.78 32.39,24.13 37.47,29.21 v38.1,29.21 40.01,27.3 49.53,27.3 52.7,30.48 | S3.2 62.84,73.64 52.7,63.5 52.7,30.48 | S3A.2 80.62,43.79 67.31,30.48 52.7,30.48
!WE  (via drill 0.3)
  Top 0.152: IC2.11 26.55,20.84 v27.94,22.23 28.57,22.86 IC3.13 | IC1.17 15.2,22.27 v15.24,22.23
  Bottom 0.152: v27.94,22.23 v15.24,22.23
+3V3  (via drill 0.3)
  Top 0.152: IC1.40 5.59,36.08 6.98,37.47 9.93,37.47 v11.2,36.2 | R4.1 v47.62,36.2 R3.1 | C3.1 R5.2
  Top 0.305: IC2.37 27.05,36.58 v27.3,36.83 | C2.1 20.81,39.35 arc-90 VR1.4
  Top 0.33: 38.81,26.86 IC3.98 | IC3.5 v37.47,26.86 38.81,26.86 | IC3.51 50.16,16.86 50.16,19.86 | 50.16,19.86 IC3.57 | 50.16,19.86 v50.16,24.13 3V3.TP 47.44,26.86 43.81,26.86 | IC3.88 v43.81,27.94 43.81,26.86 | 43.18,26.86 38.81,26.86 | 43.81,26.86 43.18,26.86 | IC3.38 43.81,15.88 43.18,16.51 43.18,19.05 | 43.18,26.86 v43.18,22.23 43.18,19.05 | IC3.26 37.81,19.05 43.18,19.05
  Top 0.356: v34.29,34.92 C4.1
  Top 0.406: IC1.33 v11.2,36.2 | v10.4,29.21 IC1.11 10.4,21.59 C3.1 | v14.61,40.01 VR1.4
  Bottom 0.152: 46.36,34.92 v47.62,36.2
  Bottom 0.33: C6.1 43.83,27.95 | 43.81,34.92 43.81,29.21
  Bottom 0.356: v37.47,26.86 C7.1 | C8.1 43.16,22.21 v43.18,22.23 | 43.83,27.95 v43.81,27.94 | C5.1 v50.16,24.13 | 10.4,30.48 11.43,30.48 15.88,34.92 25.4,34.92 v27.3,36.83 31.12,36.83 33.02,34.92 v34.29,34.92 43.81,34.92 46.36,34.92 | 43.81,28.57 43.81,29.21 C6.1
  Bottom 0.406: v10.4,29.21 10.4,30.48 10.4,35.4 v11.2,36.2 11.2,36.59 v14.61,40.01
  other vias: 47.62,26.67
+5V
  Top 0.152: 7.46,10.79 R2.2
  Top 0.305: C1.1 5.72,38.1
  Top 0.406: 7.44,10.97 7.46,10.95 | 12.7,38.1 5.72,38.1 1.27,38.1 1.27,17.14 7.44,10.97 | 7.46,10.79 7.44,10.79 7.44,10.97
  Top 0.813: 12.7,38.1 12.7,37.73 VR1.3
A0  (via drill 0.3)
  Top 0.152: IC3.73 64.85,27.86 v76.2,16.51
  Bottom 0.152: v76.2,16.51 82.7,10.01 82.7,4.72 X2.B
A1  (via drill 0.3)
  Top 0.152: IC3.71 63.31,26.86 v73.66,16.51
  Bottom 0.152: v73.66,16.51 78.74,11.43 78.74,4.72 X2.C
A2  (via drill 0.3)
  Top 0.152: IC3.68 62.27,25.36 v71.12,16.51
  Bottom 0.152: v71.12,16.51 74.78,12.85 74.78,4.72 X2.D
A3  (via drill 0.3)
  Top 0.152: IC3.66 60.73,24.36 v68.58,16.51
  Bottom 0.152: v68.58,16.51 70.82,14.27 70.82,4.72 X2.E
A4  (via drill 0.3)
  Top 0.152: IC3.64 59.19,23.36 v66.04,16.51
  Bottom 0.152: v66.04,16.51 66.86,15.69 66.86,4.71 X2.F
A5  (via drill 0.3)
  Top 0.152: IC3.61 58.15,21.86 v63.5,16.51
  Bottom 0.152: v63.5,16.51 63.5,9.53 62.9,8.93 62.9,4.71 X2.H
A6  (via drill 0.3)
  Top 0.152: IC3.59 56.61,20.86 v60.96,16.51
  Bottom 0.152: v60.96,16.51 60.96,11.43 58.94,9.41 X2.J
A7  (via drill 0.3)
  Top 0.152: IC3.56 55.57,19.36 v58.42,16.51
  Bottom 0.152: v58.42,16.51 58.42,12.7 54.98,9.26 54.98,4.71 X2.K
A8  (via drill 0.3)
  Top 0.152: IC3.54 54.03,18.36 v55.88,16.51
  Bottom 0.152: v55.88,16.51 55.88,13.97 51.02,9.11 X2.L
A9  (via drill 0.3)
  Top 0.152: IC3.52 53.12,17.36 53.34,17.14 v53.34,16.51
  Bottom 0.152: v53.34,16.51 53.34,15.24 47.06,8.96 X2.M
A10  (via drill 0.3)
  Top 0.152: IC3.30 39.81,16.95 40.01,17.14 v41.27,17.14
  Bottom 0.152: X2.N 43.1,15.32 v41.27,17.14
A11  (via drill 0.3)
  Top 0.152: IC3.33 41.31,15.84 v40.64,16.51
  Bottom 0.152: v40.64,16.51 40.01,16.51 39.14,15.65 X2.P
A12  (via drill 0.3)
  Top 0.152: IC3.35 42.31,17.38 v41.91,17.78
  Bottom 0.152: v41.91,17.78 40.64,17.78 38.73,15.88 38.73,12.7 35.18,9.15 X2.R
A13  (via drill 0.3)
  Top 0.152: v44.31,16.64 IC3.39
  Bottom 0.152: v44.31,16.64 42.55,18.41 40.64,18.41 38.1,15.88 38.1,13.34 34.29,9.53 31.75,9.53 31.22,9 X2.S
AB0
  Top 0.152: 23.05,36.2 IC2.45 | 23.05,36.2 23.05,36.39 29.84,43.18 35.56,43.18 46.81,31.93 IC3.82 | IC1.23 19.2,35.7 19.69,36.2 23.05,36.2
AB1  (via drill 0.3)
  Top 0.152: IC1.24 18.39,36.17 v18.41,36.2 | IC2.25 33.05,35.59 v33.66,36.2 35.56,36.2 39.81,31.94 IC3.96
  Bottom 0.152: v33.66,36.2 33.02,36.2 31.75,37.47 19.69,37.47 v18.41,36.2
AB2
  Top 0.152: IC3.25 34.01,16.86 33.05,15.91 IC2.24 33.05,14.01 31.12,12.06 8.89,12.06 2.4,18.56 IC1.1
AB3
  Top 0.152: IC3.24 33.23,17.36 32.55,16.68 IC2.23 32.55,14.14 31.12,12.7 8.89,12.7 3.2,18.39 IC1.2
AB4
  Top 0.152: IC3.23 35.01,17.86 34.92,17.78 33.02,17.78 32.05,16.82 IC2.22 32.05,14.28 31.12,13.34 8.89,13.34 3.99,18.23 IC1.3
AB5
  Top 0.152: IC3.20 33.97,19.36 31.55,16.95 IC2.21 31.55,14.41 31.12,13.97 8.89,13.97 4.8,18.07 IC1.4
AB6  (via drill 0.3)
  Top 0.152: IC2.20 31.05,17.72 v31.75,18.41 33.2,19.86 IC3.19 | IC1.5 5.59,20.44 v7.62,18.41
  Bottom 0.152: v31.75,18.41 v7.62,18.41
AB7  (via drill 0.3)
  Top 0.152: IC2.19 30.55,18.49 v31.12,19.05 32.42,20.36 IC3.18 | IC1.18 16,21.47 v18.41,19.05
  Bottom 0.152: v31.12,19.05 v18.41,19.05
AB8  (via drill 0.3)
  Top 0.152: IC2.18 30.05,19.26 v30.48,19.68 31.66,20.86 IC3.17 | IC1.19 16.8,21.94 v19.05,19.68
  Bottom 0.152: v30.48,19.68 v19.05,19.68
AB9  (via drill 0.3)
  Top 0.152: IC2.8 25.05,22.52 v26.04,23.5 26.9,24.36 IC3.10 | v20.32,23.5 19.28,23.5 IC1.22
  Bottom 0.152: v20.32,23.5 v26.04,23.5
AB10  (via drill 0.3)
  Top 0.152: IC2.7 24.55,23.29 v25.4,24.13 26.13,24.86 IC3.9 | IC1.44 2.4,32.53 4.45,30.48 11.43,30.48 v14.61,27.3
  Bottom 0.152: v14.61,27.3 17.78,24.13 v25.4,24.13
AB11  (via drill 0.3)
  Top 0.152: IC2.6 24.05,24.05 v24.77,24.77 25.36,25.36 IC3.8 | IC1.43 3.2,33 5.08,31.11 12.06,31.11 v15.88,27.3
  Bottom 0.152: v15.88,27.3 18.41,24.77 v24.77,24.77
AB12  (via drill 0.3)
  Top 0.152: IC2.5 23.55,24.82 v24.13,25.4 24.59,25.86 IC3.7 | IC1.42 3.99,33.47 5.72,31.75 12.7,31.75 v17.14,27.3
  Bottom 0.152: v17.14,27.3 19.05,25.4 v24.13,25.4
AB13  (via drill 0.3)
  Top 0.152: IC2.4 23.05,25.59 v23.5,26.04 23.82,26.36 IC3.6 | IC1.39 6.4,34.24 6.98,33.66 12.06,33.66 v18.41,27.3
  Bottom 0.152: v18.41,27.3 19.69,26.04 v23.5,26.04
AB14  (via drill 0.3)
  Top 0.152: IC3.4 23.55,27.36 v22.86,26.67 22.55,26.36 IC2.3 | IC1.28 15.2,31.8 v19.69,27.3
  Bottom 0.152: v19.69,27.3 20.32,26.67 v22.86,26.67
AB15  (via drill 0.3)
  Top 0.152: IC2.2 22.05,27.14 v22.23,27.3 22.78,27.86 IC3.3 | IC1.27 16,32.27 v20.96,27.3
  Bottom 0.152: v22.23,27.3 v20.96,27.3
AB16
  Top 0.152: IC2.1 21.55,27.91 22.01,28.36 | IC1.26 16.8,33.37 21.8,28.36 22.01,28.36 | 22.01,28.36 IC3.2
AB17
  Top 0.152: IC3.1 25.75,28.86 21.55,33.05 | 21.55,33.05 IC2.48 | IC1.25 17.6,33.84 18.41,33.02 21.52,33.02 21.55,33.05
AB18  (via drill 0.3)
  Top 0.152: IC2.17 29.55,20.03 v29.84,20.32 30.89,21.36 IC3.16 | IC1.20 17.6,22.41 v19.69,20.32
  Bottom 0.152: v29.84,20.32 v19.69,20.32
AB19  (via drill 0.3)
  Top 0.152: IC2.16 29.05,20.8 v29.21,20.95 30.12,21.86 IC3.15 | IC1.21 18.39,22.88 v20.32,20.95
  Bottom 0.152: v29.21,20.95 v20.32,20.95
AB20
  Top 0.152: IC2.9 25.55,21.75 27.67,23.86 IC3.11
AB21
  Top 0.152: IC2.10 26.05,21.61 27.8,23.36 IC3.12
AB22
  Top 0.152: IC2.13 27.55,20.57 29.34,22.36 IC3.14
ACC/!WP  (via drill 0.3)
  Top 0.152: IC2.14 28.05,17.58 v28.26,17.78 | R5.1 12.06,19.7 WP.2
  Bottom 0.152: v28.26,17.78 13.97,17.78 WP.2
CLK  (via drill 0.3)
  Top 0.152: IC3.22 34.34,18.36 v34.29,18.41
  Bottom 0.152: v34.29,18.41 33.66,17.78 33.66,16.51 29.21,12.06 22.23,12.06 19.34,9.18 19.34,4.71 X2.V
CR/!W
  Top 0.152: IC3.34 41.81,13.88 40.64,12.7 33.02,12.7 31.12,10.79 20.96,10.79 19.34,9.18 19.34,4.71 X2.18
D0
  Top 0.152: IC3.74 65.62,28.36 82.7,11.28 82.7,4.72 X2.2
D1
  Top 0.152: IC3.72 64.08,27.36 78.74,12.7 78.74,4.72 X2.3
D2
  Top 0.152: IC3.70 62.54,26.36 74.78,14.12 74.78,4.72 X2.4
D3
  Top 0.152: IC3.67 61.5,24.86 70.82,15.54 70.82,4.72 X2.5
D4
  Top 0.152: IC3.65 59.96,23.86 66.86,16.96 66.86,4.71 X2.6
D5
  Top 0.152: IC3.63 58.42,22.86 64.14,17.14 64.14,10.16 62.9,8.93 62.9,4.71 X2.7
D6
  Top 0.152: IC3.60 57.38,21.36 61.59,17.14 61.59,12.06 58.94,9.41 X2.8
D7
  Top 0.152: IC3.58 55.84,20.36 59.05,17.14 59.05,13.34 54.98,9.26 54.98,4.71 X2.9
DB0  (via drill 0.3)
  Top 0.152: v28.57,30.48 31.05,32.96 IC2.29 31.05,36.77 32.39,38.1 35.56,38.1 41.31,32.34 IC3.93 | v12.8,25.5 IC1.14
  Bottom 0.152: v28.57,30.48 15.88,30.48 12.8,27.4 v12.8,25.5
DB1  (via drill 0.3)
  Top 0.152: v27.94,31.11 30.05,33.23 IC2.31 30.05,36.41 32.39,38.73 35.56,38.73 41.81,32.48 IC3.92 | v11.99,25.96 IC1.13
  Bottom 0.152: v27.94,31.11 15.88,31.11 11.99,27.23 v11.99,25.96
DB2  (via drill 0.3)
  Top 0.152: v27.3,31.75 29.05,33.5 IC2.33 29.05,36.04 32.39,39.37 35.56,39.37 42.31,32.62 IC3.91 | v9.59,24.84 IC1.10
  Bottom 0.152: v9.59,24.84 9.52,24.84 9.52,25.4 15.88,31.75 v27.3,31.75
DB3  (via drill 0.3)
  Top 0.152: v26.67,32.38 28.05,33.77 IC2.35 28.05,36.31 31.75,40.01 35.56,40.01 42.81,32.75 IC3.90 | v8.8,25.3 IC1.9
  Bottom 0.152: v26.67,32.38 15.88,32.38 v8.8,25.3
DB4  (via drill 0.3)
  Top 0.152: IC2.38 26.55,37.35 29.84,40.64 v32.39,40.64 35.56,40.64 43.31,32.88 IC3.89 | IC1.31 12.8,35.66 v13.34,36.2
  Bottom 0.152: v13.34,36.2 17.78,40.64 v32.39,40.64
DB5  (via drill 0.3)
  Top 0.152: IC2.40 25.55,36.98 29.84,41.27 v31.75,41.27 35.56,41.27 44.31,32.52 IC3.87 | IC1.32 12.06,34.91 v12.06,36.2
  Bottom 0.152: v12.06,36.2 17.14,41.27 v31.75,41.27
DB6  (via drill 0.3)
  Top 0.152: IC2.42 24.55,36.62 29.84,41.91 v31.12,41.91 35.56,41.91 44.81,32.66 IC3.86 | IC1.35 9.59,36.9 v9.52,36.83
  Bottom 0.152: v9.52,36.83 14.61,41.91 v31.12,41.91
DB7  (via drill 0.3)
  Top 0.152: IC2.44 23.55,36.26 29.84,42.55 v30.48,42.55 35.56,42.55 45.31,32.79 IC3.85 | IC1.36 8.8,36.1 v8.89,36.2
  Bottom 0.152: v8.89,36.2 8.89,37.47 13.97,42.55 v30.48,42.55
GND  (via drill 0.3, 1.5)
  Top 2.286: v86.69,10.79 X2.A | v3.5,10.79 3.48,10.77 X2.Z
  Bottom 2.286: X2.A v86.69,10.79 | v3.5,10.79 3.48,10.77 X2.Z
  other vias: 10.16,36.2 11.43,24.77 47.62,24.13 51.44,15.24 36.2,15.24 36.2,30.48 51.44,30.48 37.47,20.95 41.27,20.95 41.27,29.21
  pour Top: 0,75.56 90.17,75.56 90.17,9.53 0,9.53
  pour Bottom: 0,75.56 90.17,75.56 90.17,9.53 0,9.53
LED
  Top 0.152: IC3.79 48.31,31.8 52.7,36.2 R1.2
N$3
  Top 0.152: R1.1 55.88,36.2 LED1A.A 85.72,66.04 LED1.A
N$5  (via drill 0.3)
  Top 0.152: IC3.45 47.31,16.2 TDI.TP
  other vias: 47.62,16.51
N$6  (via drill 0.3)
  Top 0.152: IC3.47 48.31,18.36 TMS.TP
  other vias: 47.62,19.05
N$7  (via drill 0.3)
  Top 0.152: IC3.48 48.81,20.4 TCK.TP
  other vias: 47.62,21.59
N$8  (via drill 0.3)
  Top 0.152: IC3.83 46.31,29.89 46.99,29.21 TDO.TP
  other vias: 47.68,29.21
SW0
  Top 0.152: S1.1 27.28,73.64 35.56,65.35 35.56,43.81 | 43.18,36.2 R4.2 | IC3.81 47.31,32.06 43.18,36.2 | 35.56,43.81 43.18,36.2 | 35.56,43.81 8,43.81 S1A.1
SW1
  Top 0.152: IC3.80 47.81,31.94 50.18,34.3 R3.2 50.16,36.21 50.16,43.79 | S2.1 48.92,73.64 50.16,72.39 50.16,43.79 | 50.16,43.79 S2A.1
VR/!W
  Top 0.152: IC3.36 42.81,13.61 41.27,12.06 33.02,12.06 31.12,10.16 24.13,10.16 23.3,9.33 23.3,4.71 X2.17